# EAGLE design Beilage (EAGLE 9.6.2)
ABTEILUNG: Technische Informatik; BEARBEITER: Ihninger, Grundner; DATUM: 07/02/2022; DOKUMENTART: Schaltplan; GEZ: GruS; ID: 4AHEL; REV: 3; SCHALTPLAN: Sequencer; STATUS: Prototyp; VER: 2.0

## Sheet 1 of 5: Master Control
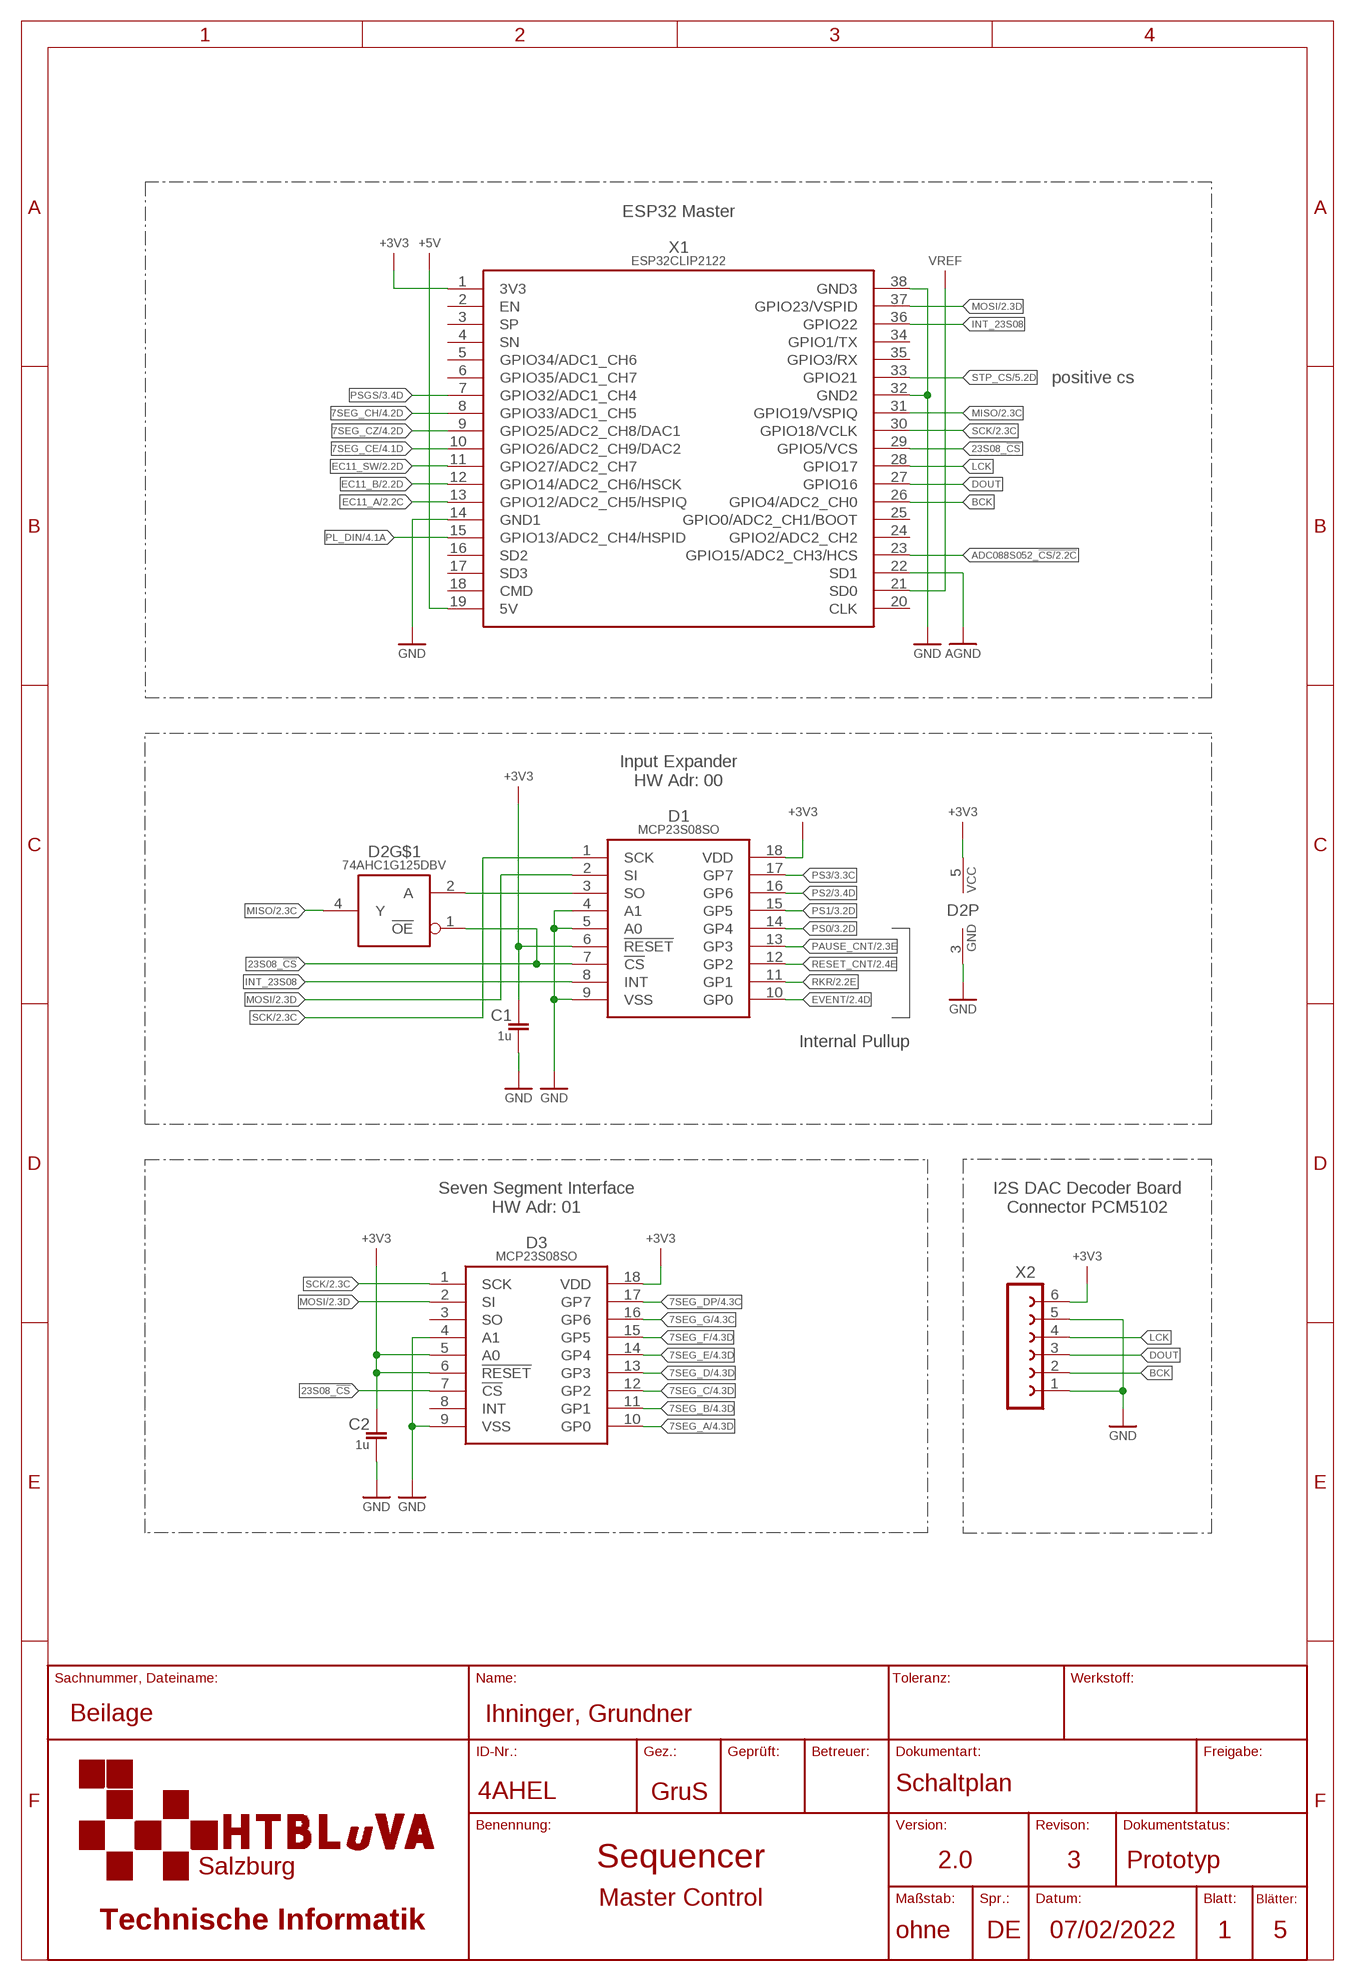
[diagram p0: schematic, sheet 1]

### Parts
C1  1u  C-EUC0805  [C0805]
C2  1u  C-EUC0805  [C0805]
D1  MCP23S08SO  [SO18W]
D2  74AHC1G125DBV  [SOT23-5]
D3  MCP23S08SO  [SO18W]
X1  ESP32CLIP2122  [ESP32-DEVKIT-C-CLIP]
X2  FE06-1  [FE06]

### Nets
7SEG_A: D3.10(GP0) ; also sheet 4
7SEG_B: D3.11(GP1) ; also sheet 4
7SEG_C: D3.12(GP2) ; also sheet 4
7SEG_CE: X1.10(GPIO26/ADC2_CH9/DAC2) ; also sheet 4
7SEG_CH: X1.8(GPIO33/ADC1_CH5) ; also sheet 4
7SEG_CZ: X1.9(GPIO25/ADC2_CH8/DAC1) ; also sheet 4
7SEG_D: D3.13(GP3) ; also sheet 4
7SEG_DP: D3.17(GP7) ; also sheet 4
7SEG_E: D3.14(GP4) ; also sheet 4
7SEG_F: D3.15(GP5) ; also sheet 4
7SEG_G: D3.16(GP6) ; also sheet 4
23S08_!CS: D1.7(!CS) D2.1(!OE) D3.7(!CS) X1.29(GPIO5/VCS)
+3V3: C1.1 C2.1 D1.6(!RESET) D1.18(VDD) D2.5(P:VCC) D3.5(A0) D3.6(!RESET) D3.18(VDD) X1.1(3V3) X2.6 ; also sheet 2,3,5
+5V: X1.19(5V) ; also sheet 2,4
ADC088S052_!CS: X1.23(GPIO15/ADC2_CH3/HCS) ; also sheet 2
AGND: X1.22(SD1) ; also sheet 2
BCK: X1.26(GPIO4/ADC2_CH0) X2.2
DOUT: X1.27(GPIO16) X2.3
EC11_A: X1.13(GPIO12/ADC2_CH5/HSPIQ) ; also sheet 2
EC11_B: X1.12(GPIO14/ADC2_CH6/HSCK) ; also sheet 2
EC11_SW: X1.11(GPIO27/ADC2_CH7) ; also sheet 2
EVENT: D1.10(GP0) ; also sheet 2
GND: C1.2 C2.2 D1.4(A1) D1.5(A0) D1.9(VSS) D2.3(P:GND) D3.4(A1) D3.9(VSS) X1.14(GND1) X1.32(GND2) X1.38(GND3) X2.1 X2.5 ; also sheet 2,3,4,5
INT_23S08: D1.8(INT) X1.36(GPIO22)
LCK: X1.28(GPIO17) X2.4
MISO: D2.4(Y) X1.31(GPIO19/VSPIQ) ; also sheet 2
MOSI: D1.2(SI) D3.2(SI) X1.37(GPIO23/VSPID) ; also sheet 2,5
N$62: D1.3(SO) D2.2(A)
PAUSE_CNT: D1.13(GP3) ; also sheet 2
PL_DIN: X1.15(GPIO13/ADC2_CH4/HSPID) ; also sheet 4
PS0: D1.14(GP4) ; also sheet 3
PS1: D1.15(GP5) ; also sheet 3
PS2: D1.16(GP6) ; also sheet 3
PS3: D1.17(GP7) ; also sheet 3
PSGS: X1.7(GPIO32/ADC1_CH4) ; also sheet 3
RESET_CNT: D1.12(GP2) ; also sheet 2
RKR: D1.11(GP1) ; also sheet 2
SCK: D1.1(SCK) D3.1(SCK) X1.30(GPIO18/VCLK) ; also sheet 2,5
STP_CS: X1.33(GPIO21) ; also sheet 5
VREF: X1.21(SD0) ; also sheet 2
Unconnected: D3.3(SO) D3.8(INT) X1.2(EN) X1.3(SP) X1.4(SN) X1.5(GPIO34/ADC1_CH6) X1.6(GPIO35/ADC1_CH7) X1.16(SD2) X1.17(SD3) X1.18(CMD) X1.20(CLK) X1.24(GPIO2/ADC2_CH2) X1.25(GPIO0/ADC2_CH1/BOOT) X1.34(GPIO1/TX) X1.35(GPIO3/RX)

### Notes on the sheet
- ESP32 Master
- positive cs
- Input Expander
  HW Adr: 00
- Internal Pullup
- Seven Segment Interface
  HW Adr: 01
- I2S DAC Decoder Board
  Connector PCM5102

## Sheet 2 of 5: User Inputs Potentiometers for Pitch Settings Switch Inputs EC-11
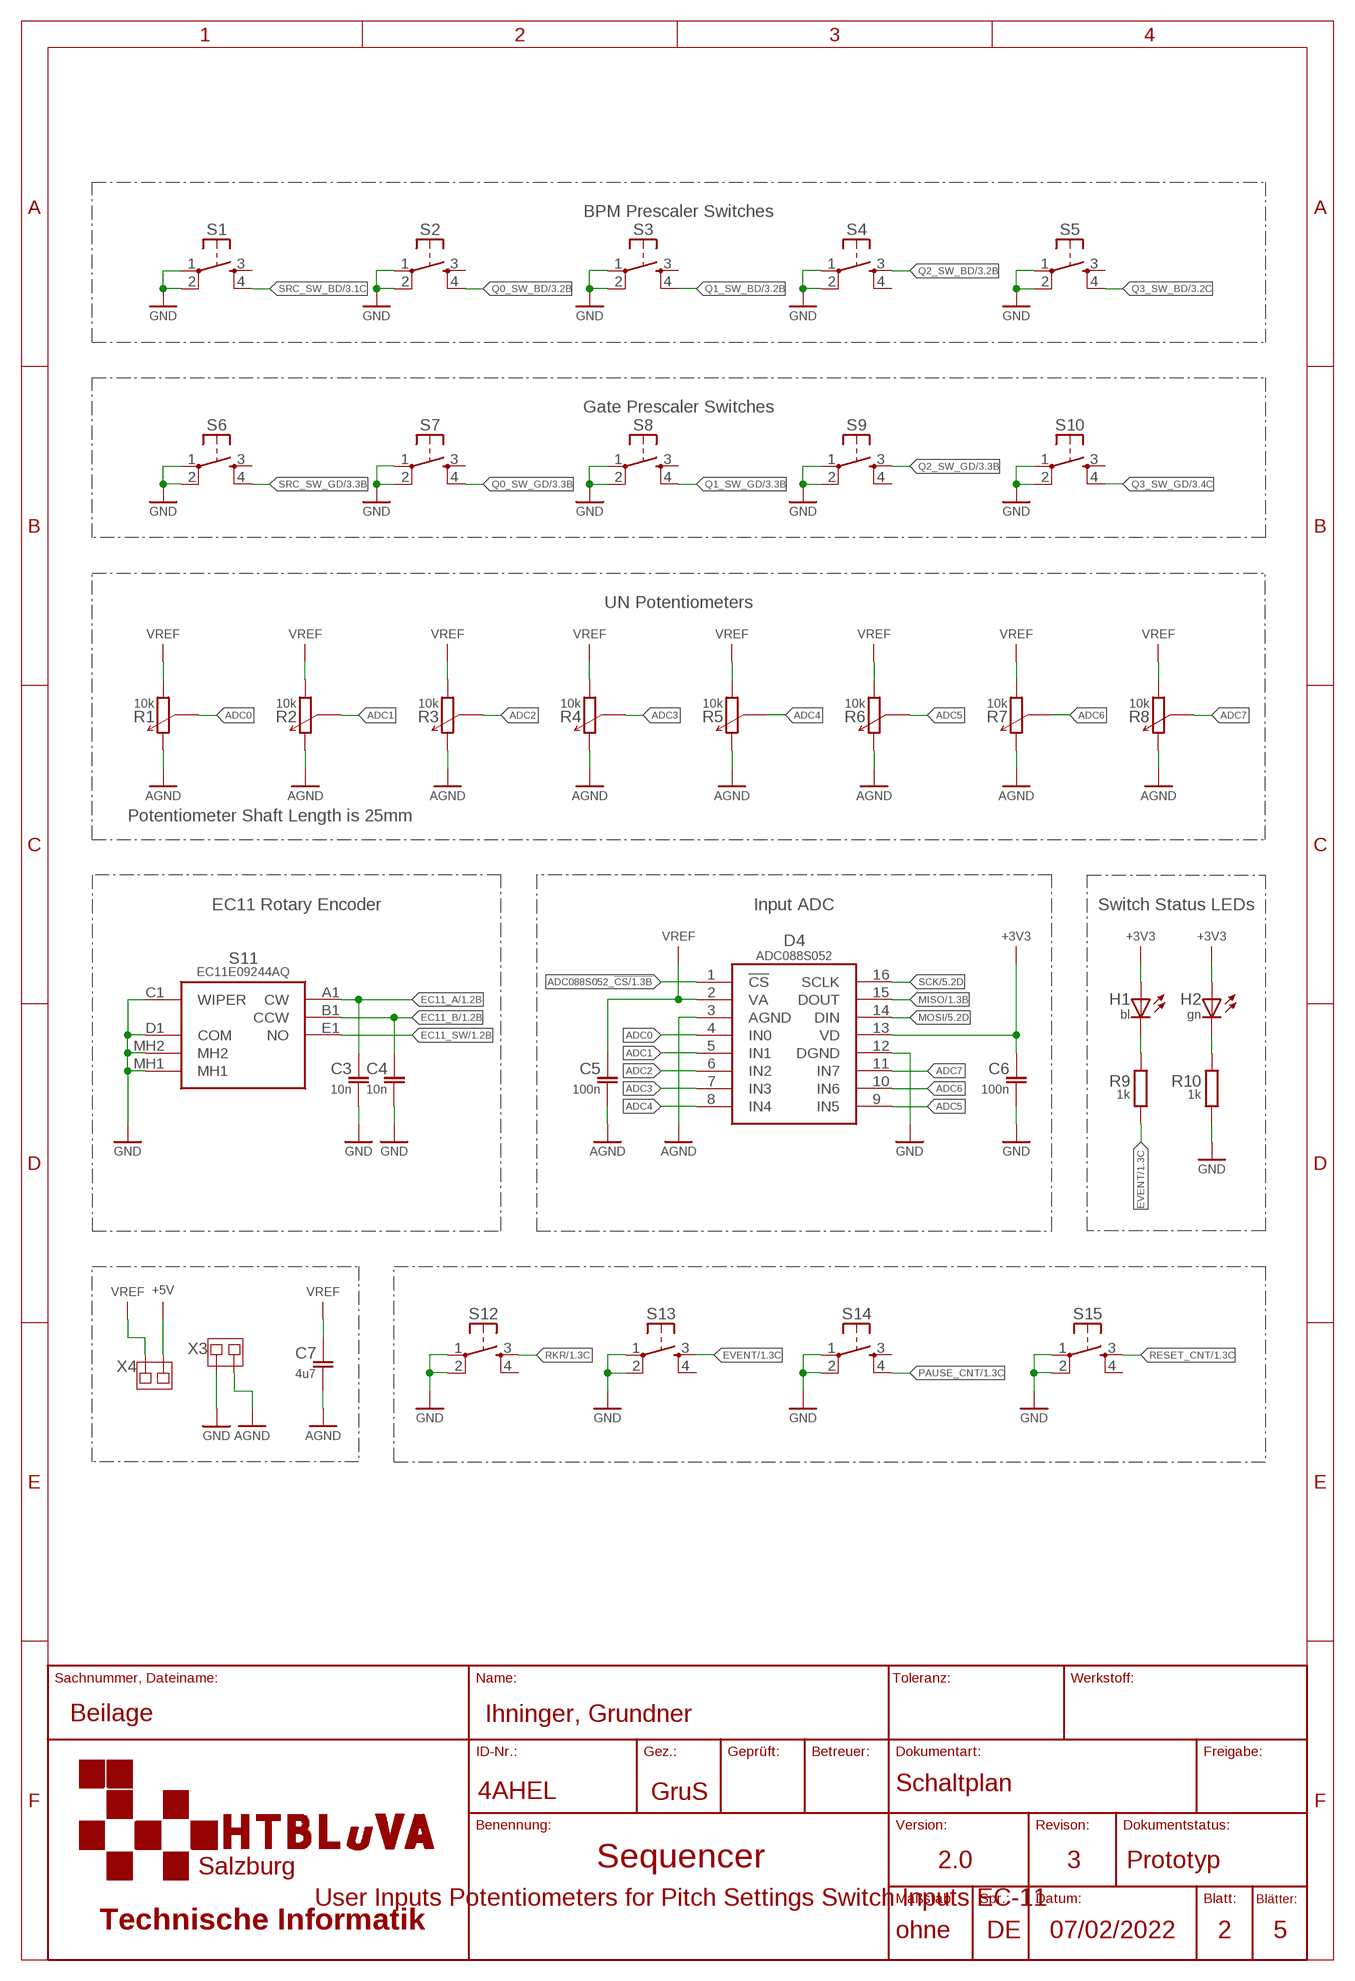
[diagram p1: schematic, sheet 2]

### Parts
C3  10n  C-EUC0805  [C0805]
C4  10n  C-EUC0805  [C0805]
C5  100n  C-EUC0805  [C0805]
C6  100n  C-EUC0805  [C0805]
C7  4u7  C-EUC0805  [C0805]
D4  ADC088S052  [TSSOP16]
H1  bl  LEDCHIPLED_1206  [CHIPLED_1206]
H2  gn  LEDCHIPLED_1206  [CHIPLED_1206]
R1  10k  P160LB  [P160LB]
R2  10k  P160LB  [P160LB]
R3  10k  P160LB  [P160LB]
R4  10k  P160LB  [P160LB]
R5  10k  P160LB  [P160LB]
R6  10k  P160LB  [P160LB]
R7  10k  P160LB  [P160LB]
R8  10k  P160LB  [P160LB]
R9  1k  R-EUSR0805  [R0805]
R10  1k  R-EUSR0805  [R0805]
S1  TASTE10XX  [B3F-10XX]
S2  TASTE10XX  [B3F-10XX]
S3  TASTE10XX  [B3F-10XX]
S4  TASTE10XX  [B3F-10XX]
S5  TASTE10XX  [B3F-10XX]
S6  TASTE10XX  [B3F-10XX]
S7  TASTE10XX  [B3F-10XX]
S8  TASTE10XX  [B3F-10XX]
S9  TASTE10XX  [B3F-10XX]
S10  TASTE10XX  [B3F-10XX]
S11  EC11E09244AQ  [EC11]
S12  TASTE10XX  [B3F-10XX]
S13  TASTE10XX  [B3F-10XX]
S14  TASTE10XX  [B3F-10XX]
S15  TASTE10XX  [B3F-10XX]
X3  JUMPSMD1FACH-1  [MYLIB_SJ]
X4  JUMPSMD1FACH-1  [MYLIB_SJ]

### Nets
+3V3: C6.1 D4.13(VD) H1.A H2.A ; also sheet 1,3,5
+5V: X4.1 ; also sheet 1,4
ADC0: D4.4(IN0) R1.2
ADC1: D4.5(IN1) R2.2
ADC2: D4.6(IN2) R3.2
ADC3: D4.7(IN3) R4.2
ADC4: D4.8(IN4) R5.2
ADC5: D4.9(IN5) R6.2
ADC6: D4.10(IN6) R7.2
ADC7: D4.11(IN7) R8.2
ADC088S052_!CS: D4.1(!CS) ; also sheet 1
AGND: C5.2 C7.2 D4.3(AGND) R1.3 R2.3 R3.3 R4.3 R5.3 R6.3 R7.3 R8.3 X3.2 ; also sheet 1
EC11_A: C3.1 S11.A1(CW) ; also sheet 1
EC11_B: C4.1 S11.B1(CCW) ; also sheet 1
EC11_SW: S11.E1(NO) ; also sheet 1
EVENT: R9.1 S13.3(S) ; also sheet 1
GND: C3.2 C4.2 C6.2 D4.12(DGND) R10.1 S1.1(P) S1.2(P1) S2.1(P) S2.2(P1) S3.1(P) S3.2(P1) S4.1(P) S4.2(P1) S5.1(P) S5.2(P1) S6.1(P) S6.2(P1) S7.1(P) S7.2(P1) S8.1(P) S8.2(P1) S9.1(P) S9.2(P1) S10.1(P) S10.2(P1) S11.C1(WIPER) S11.D1(COM) S11.MH1 S11.MH2 S12.1(P) S12.2(P1) S13.1(P) S13.2(P1) S14.1(P) S14.2(P1) S15.1(P) S15.2(P1) X3.1 ; also sheet 1,3,4,5
MISO: D4.15(DOUT) ; also sheet 1
MOSI: D4.14(DIN) ; also sheet 1,5
N$9: H2.C R10.2
N$58: H1.C R9.2
PAUSE_CNT: S14.4(S1) ; also sheet 1
Q0_SW_BD: S2.4(S1) ; also sheet 3
Q0_SW_GD: S7.4(S1) ; also sheet 3
Q1_SW_BD: S3.4(S1) ; also sheet 3
Q1_SW_GD: S8.4(S1) ; also sheet 3
Q2_SW_BD: S4.3(S) ; also sheet 3
Q2_SW_GD: S9.3(S) ; also sheet 3
Q3_SW_BD: S5.4(S1) ; also sheet 3
Q3_SW_GD: S10.4(S1) ; also sheet 3
RESET_CNT: S15.3(S) ; also sheet 1
RKR: S12.3(S) ; also sheet 1
SCK: D4.16(SCLK) ; also sheet 1,5
SRC_SW_BD: S1.4(S1) ; also sheet 3
SRC_SW_GD: S6.4(S1) ; also sheet 3
VREF: C5.1 C7.1 D4.2(VA) R1.1 R2.1 R3.1 R4.1 R5.1 R6.1 R7.1 R8.1 X4.2 ; also sheet 1
Unconnected: S1.3(S) S2.3(S) S3.3(S) S4.4(S1) S5.3(S) S6.3(S) S7.3(S) S8.3(S) S9.4(S1) S10.3(S) S12.4(S1) S13.4(S1) S14.3(S) S15.4(S1)

### Notes on the sheet
- BPM Prescaler Switches
- Gate Prescaler Switches
- UN Potentiometers
- Potentiometer Shaft Length is 25mm
- EC11 Rotary Encoder | Input ADC | Switch Status LEDs

## Sheet 3 of 5: Prescaler
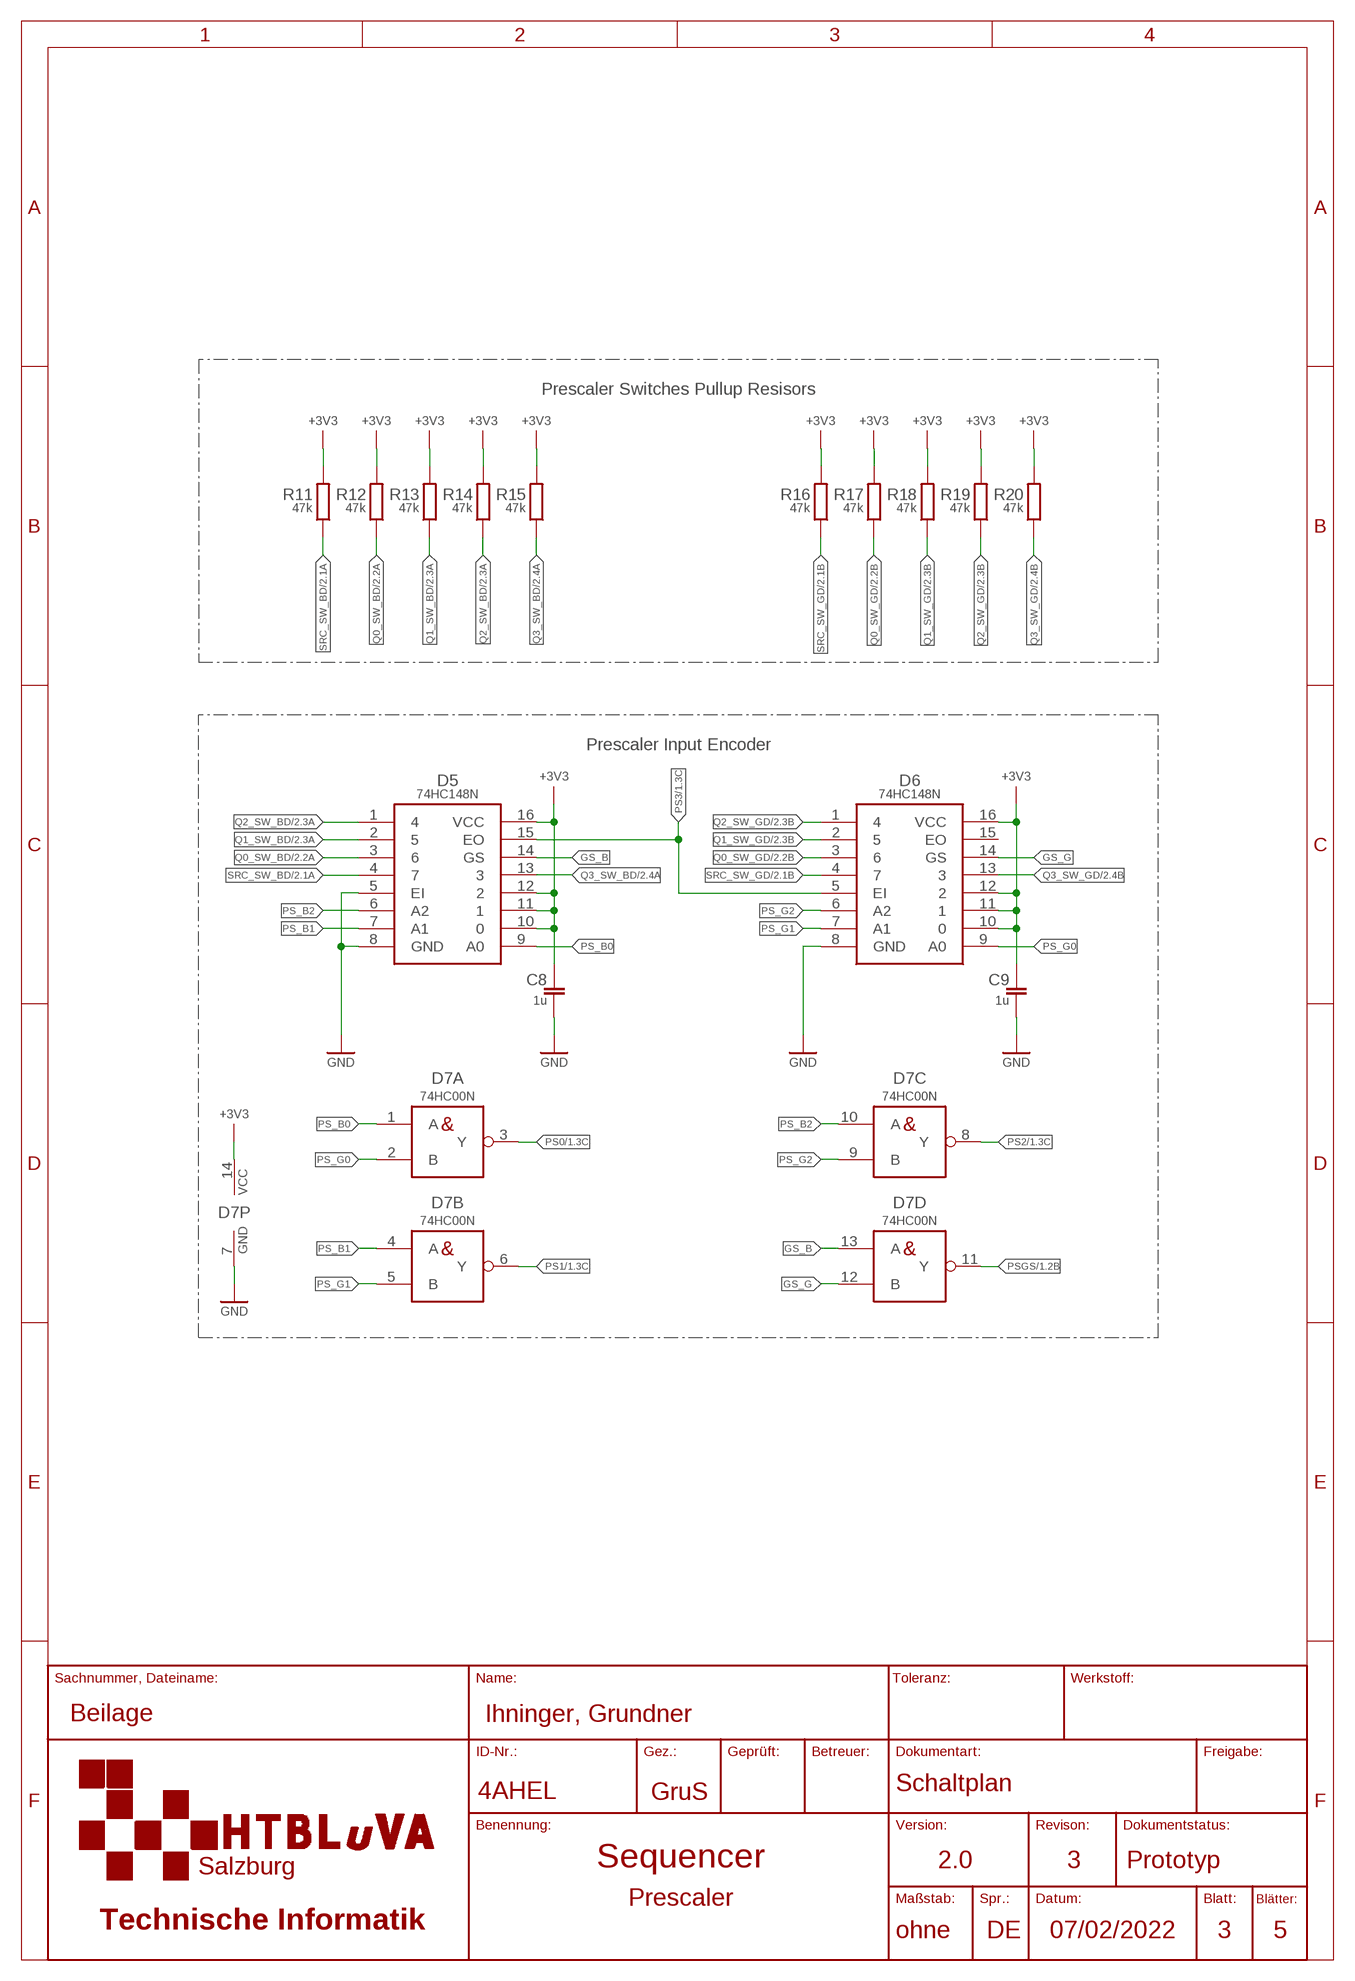
[diagram p2: schematic, sheet 3]

### Parts
C8  1u  C-EUC0805  [C0805]
C9  1u  C-EUC0805  [C0805]
D5  74HC148N  [DIP16]
D6  74HC148N  [DIP16]
D7  74HC00N  [DIP14]
R11  47k  R-EUSR0805  [R0805]
R12  47k  R-EUSR0805  [R0805]
R13  47k  R-EUSR0805  [R0805]
R14  47k  R-EUSR0805  [R0805]
R15  47k  R-EUSR0805  [R0805]
R16  47k  R-EUSR0805  [R0805]
R17  47k  R-EUSR0805  [R0805]
R18  47k  R-EUSR0805  [R0805]
R19  47k  R-EUSR0805  [R0805]
R20  47k  R-EUSR0805  [R0805]

### Nets
+3V3: C8.1 C9.1 D5.10 D5.11 D5.12 D5.16(VCC) D6.10 D6.11 D6.12 D6.16(VCC) D7.14(P:VCC) R11.2 R12.2 R13.2 R14.2 R15.2 R16.2 R17.2 R18.2 R19.2 R20.2 ; also sheet 1,2,5
GND: C8.2 C9.2 D5.5(EI) D5.8(GND) D6.8(GND) D7.7(P:GND) ; also sheet 1,2,4,5
GS_B: D5.14(GS) D7.13(D:A)
GS_G: D6.14(GS) D7.12(D:B)
PS0: D7.3(A:Y) ; also sheet 1
PS1: D7.6(B:Y) ; also sheet 1
PS2: D7.8(C:Y) ; also sheet 1
PS3: D5.15(EO) D6.5(EI) ; also sheet 1
PS_B0: D5.9(A0) D7.1(A:A)
PS_B1: D5.7(A1) D7.4(B:A)
PS_B2: D5.6(A2) D7.10(C:A)
PS_G0: D6.9(A0) D7.2(A:B)
PS_G1: D6.7(A1) D7.5(B:B)
PS_G2: D6.6(A2) D7.9(C:B)
PSGS: D7.11(D:Y) ; also sheet 1
Q0_SW_BD: D5.3 R12.1 ; also sheet 2
Q0_SW_GD: D6.3 R17.1 ; also sheet 2
Q1_SW_BD: D5.2 R13.1 ; also sheet 2
Q1_SW_GD: D6.2 R18.1 ; also sheet 2
Q2_SW_BD: D5.1 R14.1 ; also sheet 2
Q2_SW_GD: D6.1 R19.1 ; also sheet 2
Q3_SW_BD: D5.13 R15.1 ; also sheet 2
Q3_SW_GD: D6.13 R20.1 ; also sheet 2
SRC_SW_BD: D5.4 R11.1 ; also sheet 2
SRC_SW_GD: D6.4 R16.1 ; also sheet 2
Unconnected: D6.15(EO)

### Notes on the sheet
- Prescaler Switches Pullup Resisors
- Prescaler Input Encoder

## Sheet 4 of 5: Display & LEDs PL9823-F5 Rotating LEDs 7 Segment Display
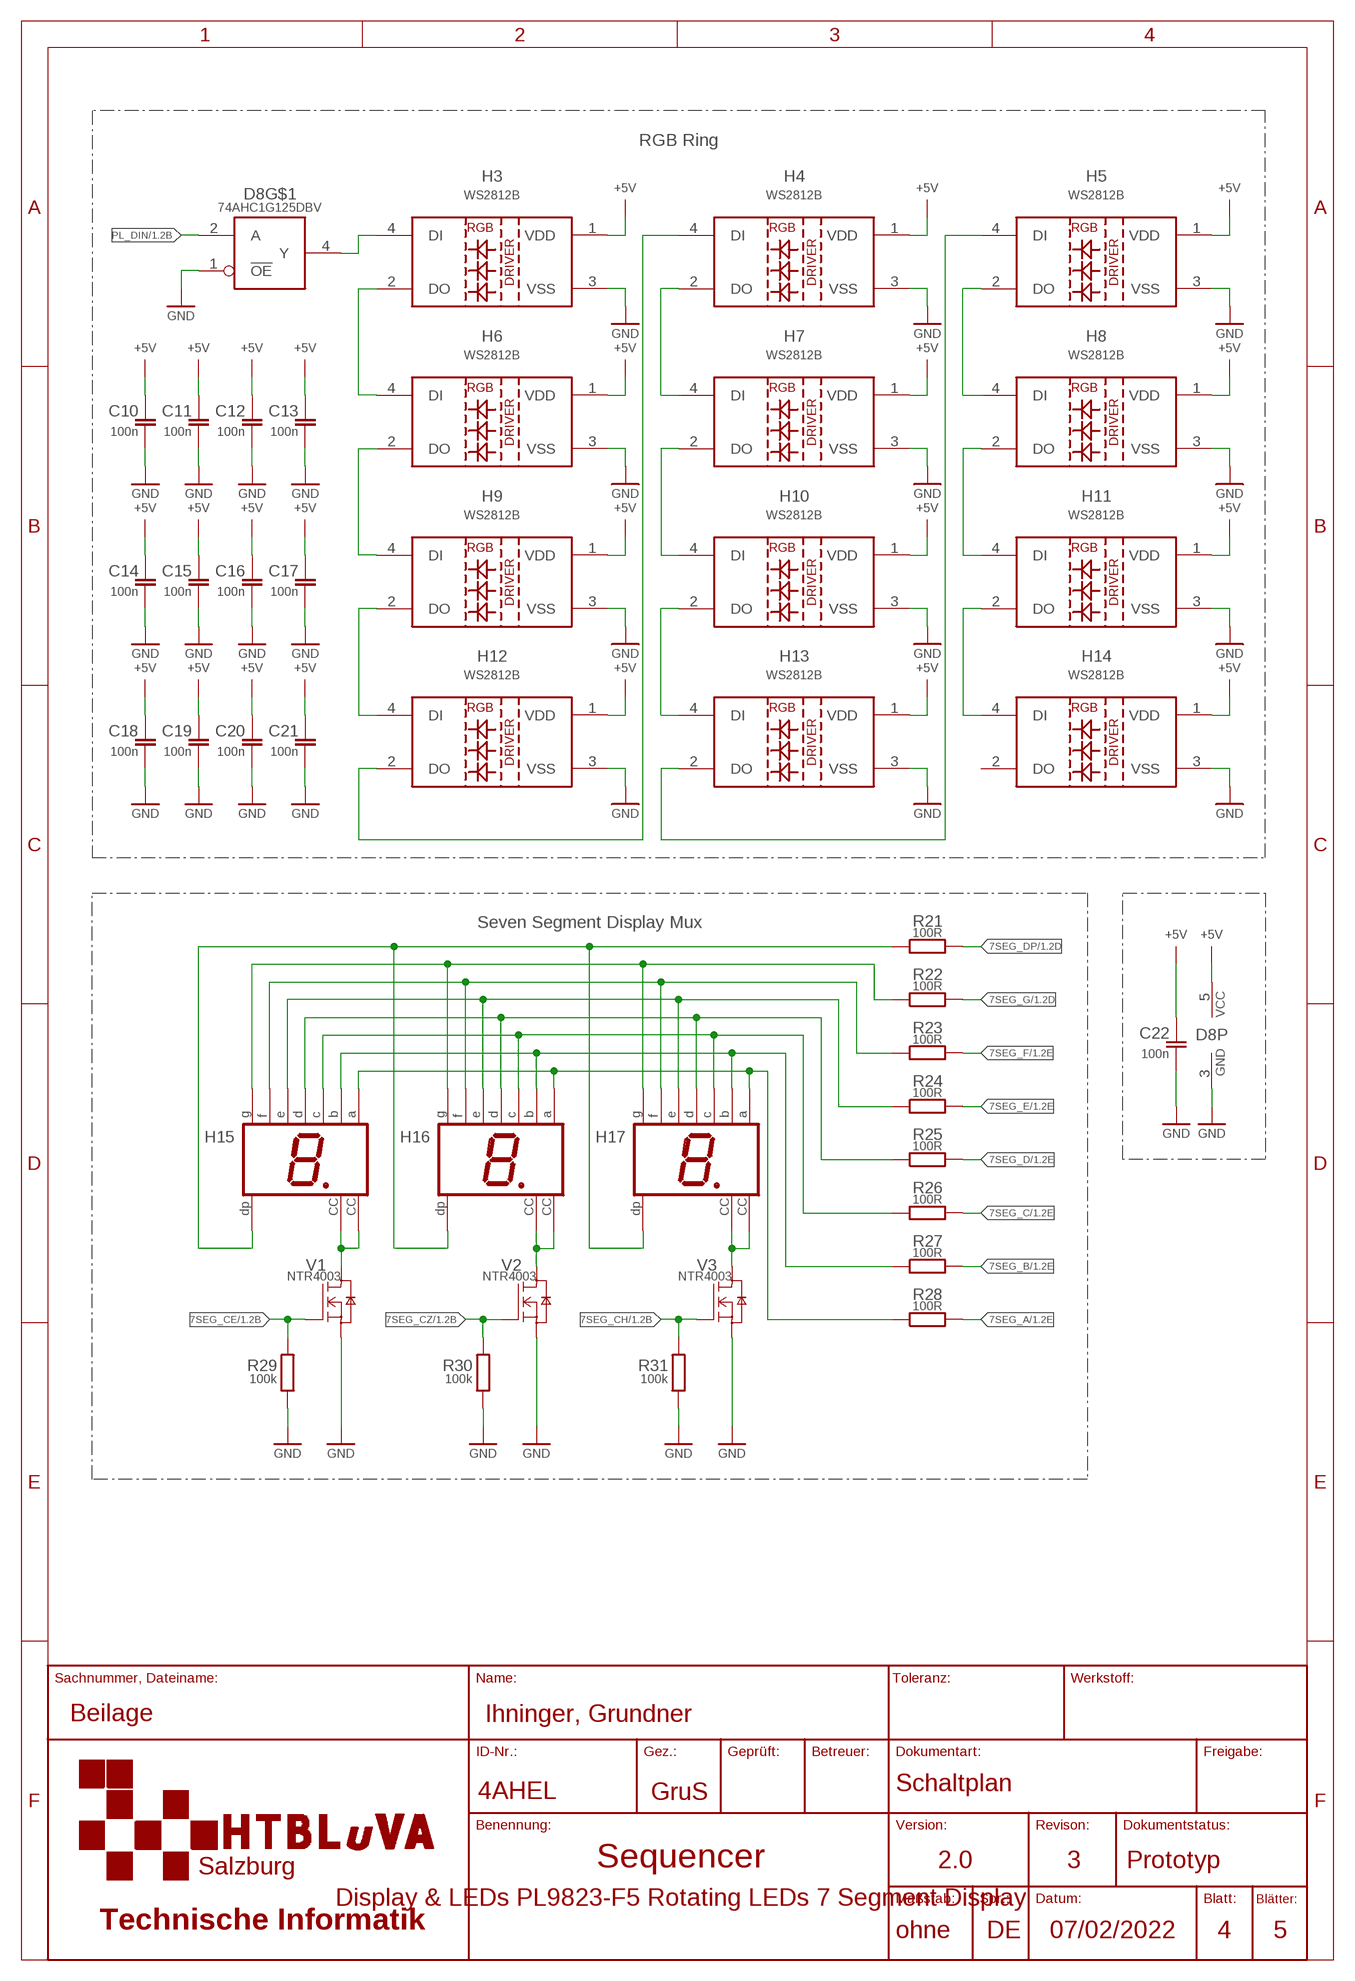
[diagram p3: schematic, sheet 4]

### Parts
C10  100n  C-EUC0805  [C0805]
C11  100n  C-EUC0805  [C0805]
C12  100n  C-EUC0805  [C0805]
C13  100n  C-EUC0805  [C0805]
C14  100n  C-EUC0805  [C0805]
C15  100n  C-EUC0805  [C0805]
C16  100n  C-EUC0805  [C0805]
C17  100n  C-EUC0805  [C0805]
C18  100n  C-EUC0805  [C0805]
C19  100n  C-EUC0805  [C0805]
C20  100n  C-EUC0805  [C0805]
C21  100n  C-EUC0805  [C0805]
C22  100n  C-EUC0805  [C0805]
D8  74AHC1G125DBV  [SOT23-5]
H3  WS2812B  [WS2812B]
H4  WS2812B  [WS2812B]
H5  WS2812B  [WS2812B]
H6  WS2812B  [WS2812B]
H7  WS2812B  [WS2812B]
H8  WS2812B  [WS2812B]
H9  WS2812B  [WS2812B]
H10  WS2812B  [WS2812B]
H11  WS2812B  [WS2812B]
H12  WS2812B  [WS2812B]
H13  WS2812B  [WS2812B]
H14  WS2812B  [WS2812B]
H15  HD-H103  [HDSP-E]
H16  HD-H103  [HDSP-E]
H17  HD-H103  [HDSP-E]
R21  100R  R-EU_R0805  [R0805]
R22  100R  R-EU_R0805  [R0805]
R23  100R  R-EU_R0805  [R0805]
R24  100R  R-EU_R0805  [R0805]
R25  100R  R-EU_R0805  [R0805]
R26  100R  R-EU_R0805  [R0805]
R27  100R  R-EU_R0805  [R0805]
R28  100R  R-EU_R0805  [R0805]
R29  100k  R-EUSR0805  [R0805]
R30  100k  R-EUSR0805  [R0805]
R31  100k  R-EUSR0805  [R0805]
V1  NTR4003  [SOT23]
V2  NTR4003  [SOT23]
V3  NTR4003  [SOT23]

### Nets
7SEG_A: R28.2 ; also sheet 1
7SEG_B: R27.2 ; also sheet 1
7SEG_C: R26.2 ; also sheet 1
7SEG_CE: R29.2 V1.1(G) ; also sheet 1
7SEG_CH: R31.2 V3.1(G) ; also sheet 1
7SEG_CZ: R30.2 V2.1(G) ; also sheet 1
7SEG_D: R25.2 ; also sheet 1
7SEG_DP: R21.2 ; also sheet 1
7SEG_E: R24.2 ; also sheet 1
7SEG_F: R23.2 ; also sheet 1
7SEG_G: R22.2 ; also sheet 1
+5V: C10.1 C11.1 C12.1 C13.1 C14.1 C15.1 C16.1 C17.1 C18.1 C19.1 C20.1 C21.1 C22.1 D8.5(P:VCC) H3.1(VDD) H4.1(VDD) H5.1(VDD) H6.1(VDD) H7.1(VDD) H8.1(VDD) H9.1(VDD) H10.1(VDD) H11.1(VDD) H12.1(VDD) H13.1(VDD) H14.1(VDD) ; also sheet 1,2
GND: C10.2 C11.2 C12.2 C13.2 C14.2 C15.2 C16.2 C17.2 C18.2 C19.2 C20.2 C21.2 C22.2 D8.1(!OE) D8.3(P:GND) H3.3(VSS) H4.3(VSS) H5.3(VSS) H6.3(VSS) H7.3(VSS) H8.3(VSS) H9.3(VSS) H10.3(VSS) H11.3(VSS) H12.3(VSS) H13.3(VSS) H14.3(VSS) R29.1 R30.1 R31.1 V1.2(S) V2.2(S) V3.2(S) ; also sheet 1,2,3,5
N$1: D8.4(Y) H3.4(DI)
N$2: H6.2(DO) H9.4(DI)
N$3: H3.2(DO) H6.4(DI)
N$4: H8.2(DO) H11.4(DI)
N$7: H15.DP H16.DP H17.DP R21.1
N$33: H15.G H16.G H17.G R22.1
N$35: H15.F H16.F H17.F R23.1
N$36: H15.A H16.A H17.A R28.1
N$37: H15.B H16.B H17.B R27.1
N$55: H15.CC1(CC) H15.CC2(CC) V1.3(D)
N$56: H15.D H16.D H17.D R25.1
N$57: H10.2(DO) H13.4(DI)
N$59: H5.4(DI) H13.2(DO)
N$63: H5.2(DO) H8.4(DI)
N$64: H16.CC1(CC) H16.CC2(CC) V2.3(D)
N$65: H17.CC1(CC) H17.CC2(CC) V3.3(D)
N$67: H7.2(DO) H10.4(DI)
N$68: H9.2(DO) H12.4(DI)
N$69: H11.2(DO) H14.4(DI)
N$70: H4.4(DI) H12.2(DO)
N$73: H4.2(DO) H7.4(DI)
N$78: H15.C H16.C H17.C R26.1
N$80: H15.E H16.E H17.E R24.1
PL_DIN: D8.2(A) ; also sheet 1
Unconnected: H14.2(DO)

### Notes on the sheet
- RGB Ring
- Seven Segment Display Mux

## Sheet 5 of 5: LED Driver LED Register PL-9823-F5 LEDs
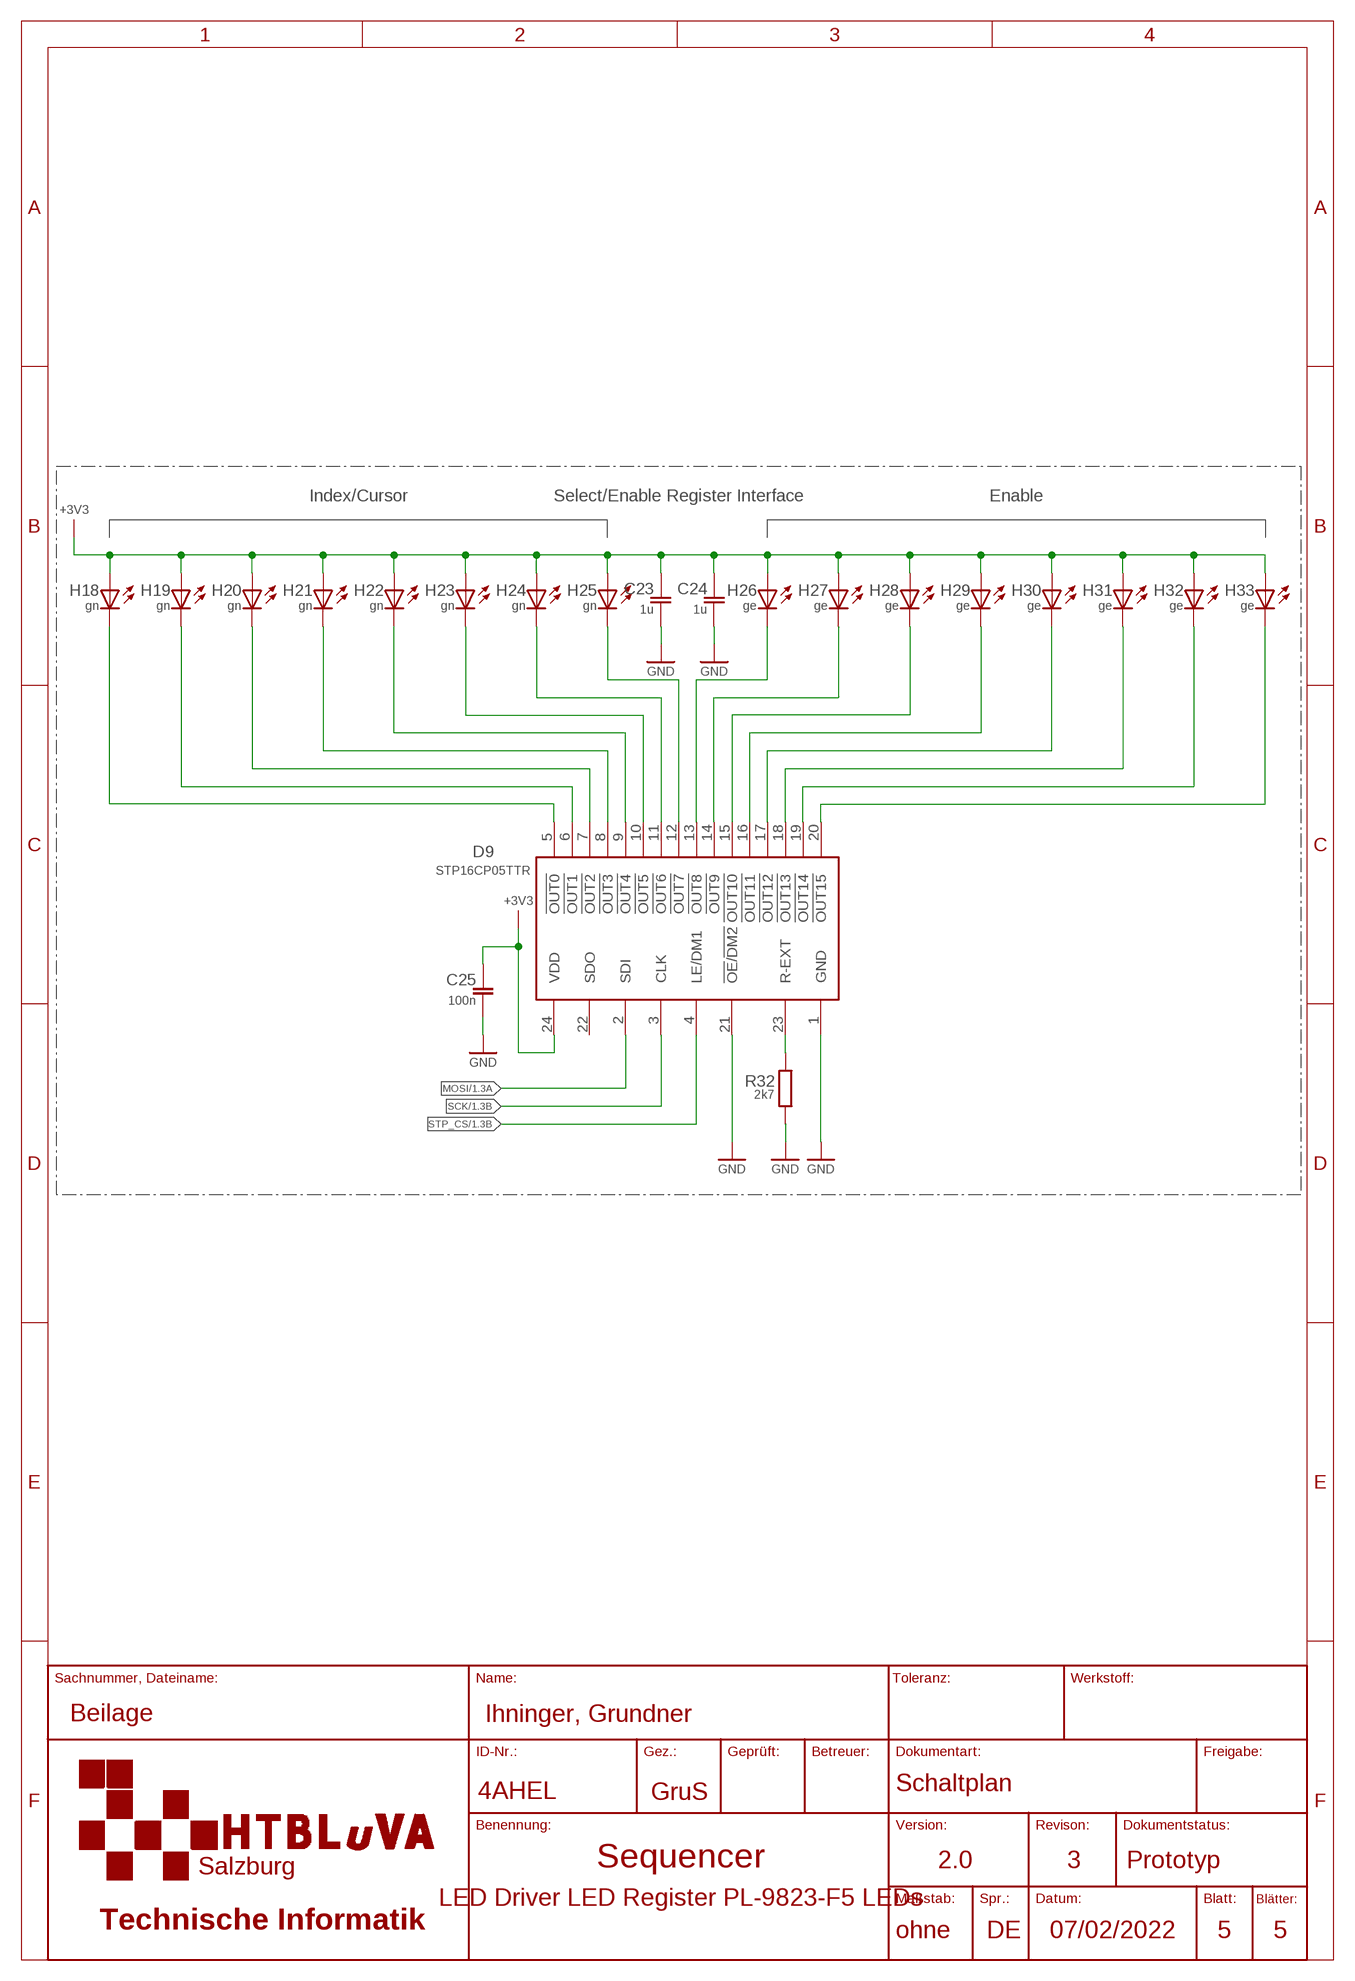
[diagram p4: schematic, sheet 5]

### Parts
C23  1u  C-EUC0805  [C0805]
C24  1u  C-EUC0805  [C0805]
C25  100n  C-EUC0805  [C0805]
D9  STP16CP05TTR  [TSSOP24]
H18  gn  LED5MM  [LED5MM]
H19  gn  LED5MM  [LED5MM]
H20  gn  LED5MM  [LED5MM]
H21  gn  LED5MM  [LED5MM]
H22  gn  LED5MM  [LED5MM]
H23  gn  LED5MM  [LED5MM]
H24  gn  LED5MM  [LED5MM]
H25  gn  LED5MM  [LED5MM]
H26  ge  LED5MM  [LED5MM]
H27  ge  LED5MM  [LED5MM]
H28  ge  LED5MM  [LED5MM]
H29  ge  LED5MM  [LED5MM]
H30  ge  LED5MM  [LED5MM]
H31  ge  LED5MM  [LED5MM]
H32  ge  LED5MM  [LED5MM]
H33  ge  LED5MM  [LED5MM]
R32  2k7  R-EUSR0805  [R0805]

### Nets
+3V3: C23.1 C24.1 C25.1 D9.24(VDD) H18.A H19.A H20.A H21.A H22.A H23.A H24.A H25.A H26.A H27.A H28.A H29.A H30.A H31.A H32.A H33.A ; also sheet 1,2,3
GND: C23.2 C24.2 C25.2 D9.1(GND) D9.21(!OE!/!DM2) R32.1 ; also sheet 1,2,3,4
MOSI: D9.2(SDI) ; also sheet 1,2
N$38: D9.5(!OUT0) H18.K(C)
N$39: D9.6(!OUT1) H19.K(C)
N$40: D9.7(!OUT2) H20.K(C)
N$41: D9.8(!OUT3) H21.K(C)
N$42: D9.9(!OUT4) H22.K(C)
N$43: D9.10(!OUT5) H23.K(C)
N$44: D9.11(!OUT6) H24.K(C)
N$45: D9.12(!OUT7) H25.K(C)
N$46: D9.13(!OUT8) H26.K(C)
N$47: D9.14(!OUT9) H27.K(C)
N$48: D9.15(!OUT10) H28.K(C)
N$49: D9.16(!OUT11) H29.K(C)
N$50: D9.17(!OUT12) H30.K(C)
N$51: D9.18(!OUT13) H31.K(C)
N$52: D9.19(!OUT14) H32.K(C)
N$53: D9.20(!OUT15) H33.K(C)
N$54: D9.23(R-EXT) R32.2
SCK: D9.3(CLK) ; also sheet 1,2
STP_CS: D9.4(LE/DM1) ; also sheet 1
Unconnected: D9.22(SDO)

### Notes on the sheet
- Index/Cursor | Select/Enable Register Interface | Enable

## Library data of the parts
C1-C25 = rcl_GruS:C-EU: CAPACITOR, European symbol; CATEGORY: 2
D1 D3 = ic_GruS:MCP23S08: 8-bit I/O Expander,SPI,MCP23S08-E/SO Source: Datasheet <https://datasheet.datasheetarchive.com/originals/distributors/SFDatasheet-4/sf-00090055.pdf>; ARROW_PART_NUMBER: MCP23S08-E/SO; ARROW_PRICE-STOCK: https://www.arrow.com/en/products/mcp23s08-eso/microchip-technology?region=nac; CATEGORY: 13; DESCRIPTION: 8-bit I/O Expander,SPI,MCP23S08-E/SO; HEIGHT: 2.65mm; MANUFACTURER_NAME: Microchip; MANUFACTURER_PART_NUMBER: MCP23S08-E/SO; MOUSER_PART_NUMBER: 579-MCP23S08-E/SO; MOUSER_PRICE-STOCK: https://www.mouser.co.uk/ProductDetail/Microchip-Technology/MCP23S08-E-SO?qs=Sez7gRs8XSXMFunLZ5Ve%2FA%3D%3D
D2 D8 = 74xx_GruS:74*1G125: Single Bus Buffer Gate with 3-State Output; CATEGORY: 13
D4 = adc-dac_GruS:ADC088S052: 8-Channel, 200 ksps to 500 ksps, 8-Bit A/D Converter Source: Datasheet <http://www.ti.com/lit/gpn/adc088s052>; ARROW_PART_NUMBER: ADC088S052CIMT/NOPB; ARROW_PRICE-STOCK: https://www.arrow.com/en/products/adc088s052cimtnopb/texas-instruments?region=nac; CATEGORY: 2; DESCRIPTION: 8-Channel, 200 ksps to 500 ksps, 8-Bit A/D Converter; HEIGHT: 1.2mm; MANUFACTURER_NAME: Texas Instruments; MANUFACTURER_PART_NUMBER: ADC088S052CIMT/NOPB; MOUSER_PART_NUMBER: 926-AD088S052CIMTNPB; MOUSER_PRICE-STOCK: https://www.mouser.co.uk/ProductDetail/Texas-Instruments/ADC088S052CIMT-NOPB?qs=7X5t%252BdzoRHDIs0QC27A8hw%3D%3D
D5 D6 = 74xx_GruS:74*148: Priority encoder,SN74HC148N DIL16 25pcs Source: Datasheet <http://www.ti.com/lit/gpn/sn74hc148>; CATEGORY: 13
D7 = 74xx_GruS:74*00: Quad 2-Input Logic NAND Datasheet Dist.: Art. Nr.:; CATEGORY: 13
D9 = ic_GruS:STP16CP05: STP16CP05 Source: Datasheet <http://www.st.com/st-web-ui/static/active/en/resource/technical/document/datasheet/CD00126634.pdf>; CATEGORY: 13
H1 H2 H18-H33 = led_GruS:LED: LED, EN-60617 OSRAM: - CHIPLED LG R971, LG N971, LY N971, LG Q971, LY Q971, LO R971, LY R971 LH N974, LH R974 LS Q976, LO Q976, LY Q976 LO Q996 - Hyper CHIPLED LW Q18S LB Q993, LB Q99A, LB R99A - SideLED LS A670, LO A670, LY A670, LG A670, LP A670 LB A673, LV A673, LT A673, LW A673 LH A674 LY A675 LS A676, LA A676, LO A676, LY A676, LW A676 LS A679, LY A679, LG A679 - Hyper Micro SIDELED® LS Y876, LA Y876, LO Y876, LY Y876 LT Y87S - SmartLED LW L88C, LW L88S LB L89C, LB L89S, LG L890 LS L89K, LO L89K, LY L89K LS L896, LA L896, LO L896, LY L896 - TOPLED LS T670, LO T670, LY T670, LG T670, LP T670 LSG T670, LSP T670, LSY T670, LOP T670, LYG T670 LG T671, LOG T671, LSG T671 LB T673, LV T673, LT T673, LW T673 LH T674 LS T676, LA T676, LO T676, LY T676, LB T676, LH T676, LSB T676, LW T676 LB T67C, LV T67C, LT T67C, LS T67K, LO T67K, LY T67K, LW E67C LS E67B, LA E67B, LO E67B, LY E67B, LB E67C, LV E67C, LT E67C LW T67C LS T679, LY T679, LG T679 LS T770, LO T770, LY T770, LG T770, LP T770 LB T773, LV T773, LT T773, LW T773 LH T774 LS E675, LA E675, LY E675, LS T675 LS T776, LA T776, LO T776, LY T776, LB T776 LHGB T686 LT T68C, LB T68C - Hyper Mini TOPLED® LB M676 - Mini TOPLED Santana® LG M470 LS M47K, LO M47K, LY M47K Source: http://www.osram.convergy.de LUXEON: - LUMILED® LXK2-PW12-R00, LXK2-PW12-S00, LXK2-PW14-U00, LXK2-PW14-V00 LXK2-PM12-R00, LXK2-PM12-S00, LXK2-PM14-U00 LXK2-PE12-Q00, LXK2-PE12-R00, LXK2-PE12-S00, LXK2-PE14-T00, LXK2-PE14-U00 LXK2-PB12-K00, LXK2-PB12-L00, LXK2-PB12-M00, LXK2-PB14-N00, LXK2-PB14-P00, LXK2-PB14-Q00 LXK2-PR12-L00, LXK2-PR12-M00, LXK2-PR14-Q00, LXK2-PR14-R00 LXK2-PD12-Q00, LXK2-PD12-R00, LXK2-PD12-S00 LXK2-PH12-R00, LXK2-PH12-S00 LXK2-PL12-P00, LXK2-PL12-Q00, LXK2-PL12-R00 Source: www.luxeon.com KINGBRIGHT: KA-3528ASYC Source: www.kingbright.com; CATEGORY: 7
H3-H14 = led_GruS:WS2812B; CATEGORY: 7
H15-H17 = display_GruS:HD-H103: LED DISPLAY 1-character 7 segment, decimal point right; CATEGORY: 15; OC_FARNELL: unknown; OC_NEWARK: unknown
R1-R8 = rcl_GruS:P160: Datasheet P160 <https://www.ttelectronics.com/TTElectronics/media/ProductFiles/Datasheets/P160.pdf> DigiKey Collection <https://www.digikey.com/en/products/filter/rotary-potentiometers-rheostats/84?s=N4IgjCBcoEwCxVAYygMwIYBsDOBTANCAPZQDaIcADDAGxgwgC6hADgC5QgDKbATgJYA7AOYgAvoRoBORCBSQMOAsTIgAzAA41NAKwNmIdpx4CR4wjB0bZ8xXkIlI5TXA1WmrDpG58hoiSA6agjQcmhY9ipO6gDslDQaEAZG3iZ%2B5oFwOjbhSg6q2jAxGpQehl4%2Bpv6EGlI0OQoRyo7OJcEIyRVpZgFglFoNds0FajCJ1p3Gvj2EfVIMobZN%2BdHaOmBgHZ5TVRlgGnAyi7mRLeBlKSAAkoJsuMK4vHtStYPLUeSlk6nT1SAwMH2bzyH3O3xAABEiABXABGmFwGQAtCFkCdhtFLBpLEwAkjssdGiCzmAYrjCEiIIShityC8yYwxEygA>
R9-R20 R29-R32 = rcl_GruS:R-EUS: RESISTOR, European symbol
R21-R28 = rcl_GruS:R-EU_: RESISTOR, European symbol
S1-S10 S12-S15 = switch_GruS:TASTE10XX: OMRON SWITCH; CATEGORY: 17
S11 = switch_GruS:EC11: Alps 9 Pulse Incremental Mechanical Rotary Encoder with a 6 mm Flat Shaft (Not Indexed), Through Hole// Source: Datasheet <https://componentsearchengine.com/Datasheets/2/EC11E09244BS.pdf>; CATEGORY: 17; DESCRIPTION: Alps 9 Pulse Incremental Mechanical Rotary Encoder with a 6 mm Flat Shaft (Not Indexed), Through Hole//; HEIGHT: 24.5mm; MANUFACTURER_NAME: ALPS; MANUFACTURER_PART_NUMBER: EC11E09244AQ; MOUSER_PART_NUMBER: 688-EC11E09244AQ; MOUSER_PRICE-STOCK: https://www.mouser.com/Search/Refine.aspx?Keyword=688-EC11E09244AQ
V1-V3 = mfet_GruS:NTR4003: Datasheet <https://www.mouser.de/datasheet/2/308/1/NTR4003N_D-2319203.pdf>; CATEGORY: 5
X1 = modul_GruS:ESP32; CATEGORY: 18
X2 = con-lsta:FE06-1: FEMALE HEADER; CATEGORY: 18
X3 X4 = con_GruS:JUMPSMD1FACH-1: SMD solder JUMPER; CATEGORY: 18

## Board
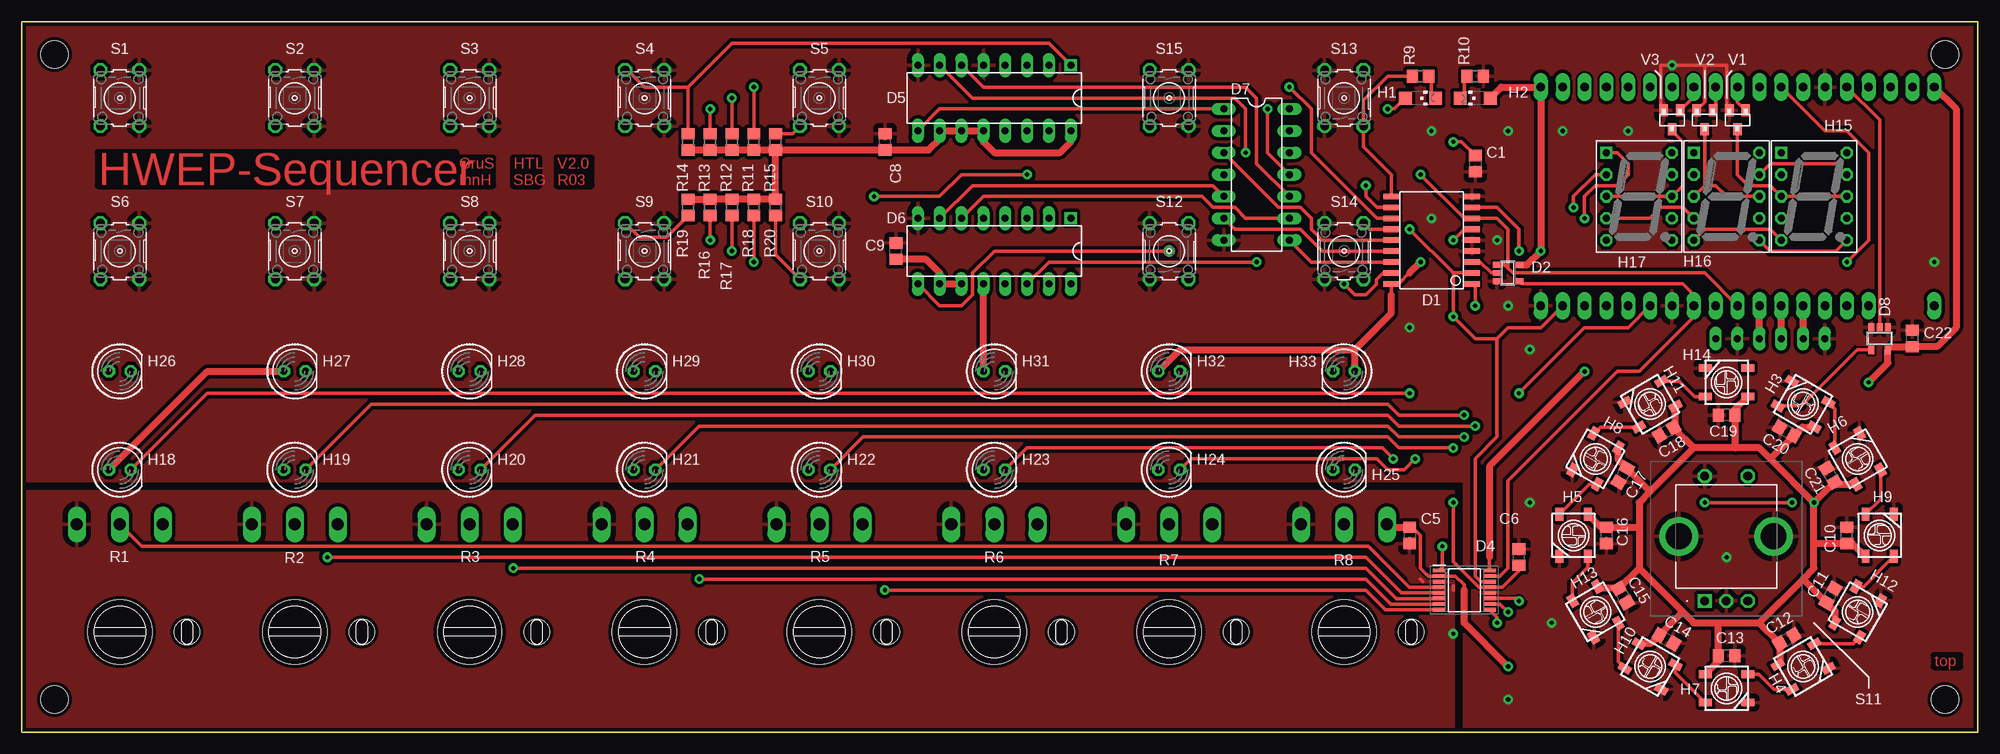
[diagram p5: board, top side]
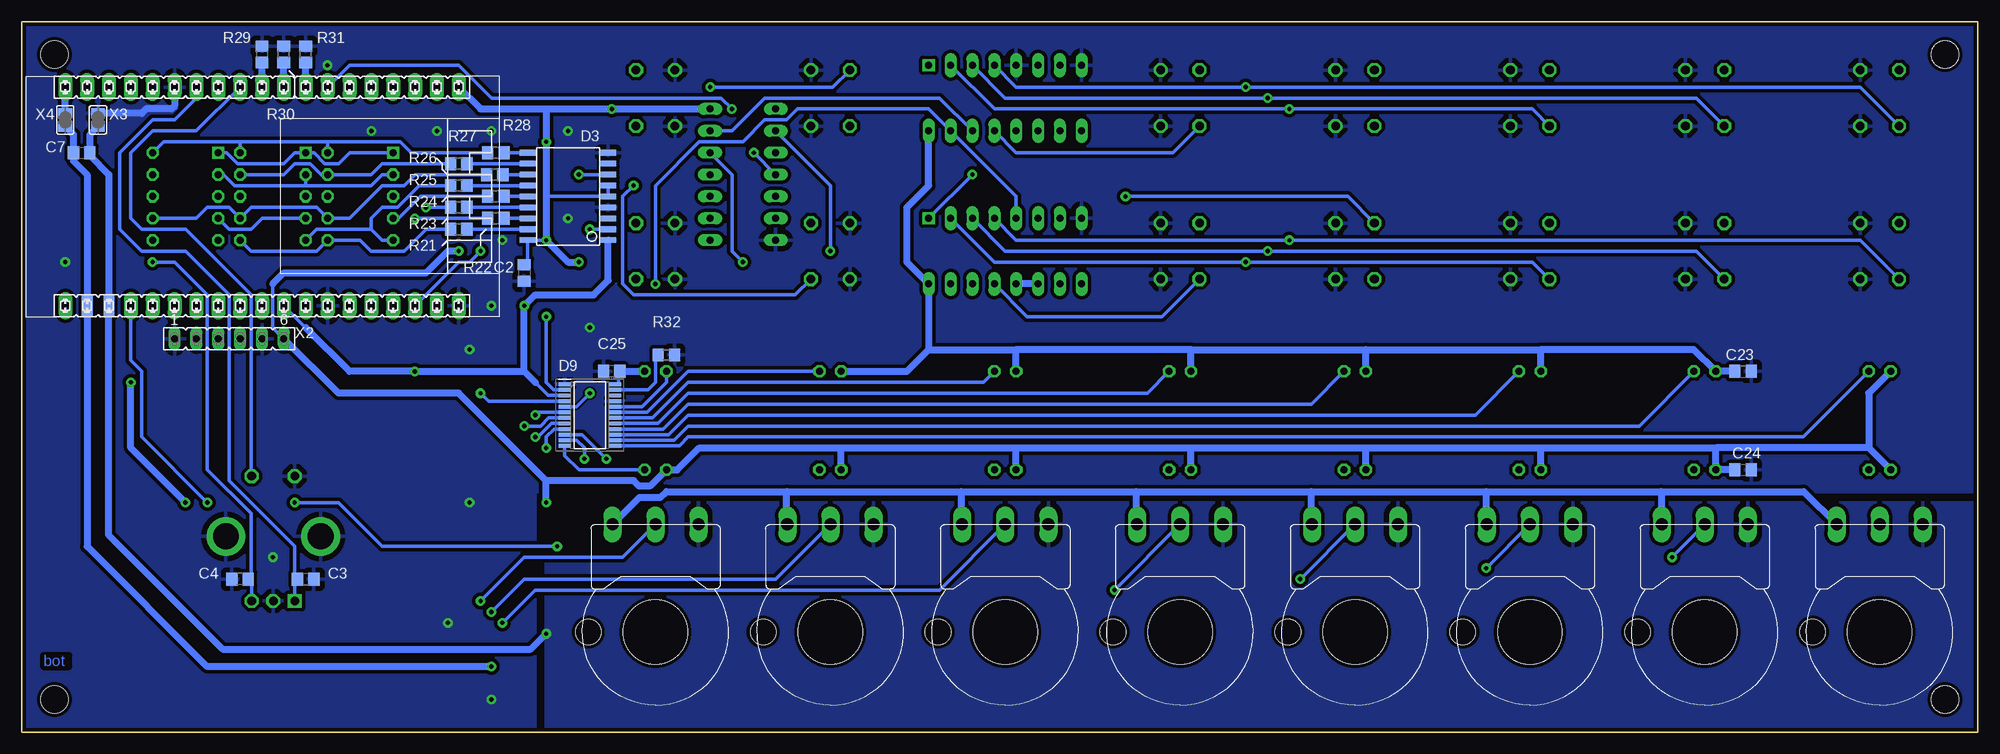
[diagram p6: board, bottom side, seen from below]

Size 227.33 x 82.55 mm. Coordinates in mm from the lower left corner, seen from the top.
Outline: 0,0 227.33,0 227.33,82.55 0,82.55 0,0
Copper layers (1+16): Top 0.035mm / dielectric 1.5mm / Bottom 0.035mm
Design rules "HTL_SMD_V1": minimum track width 10mil, minimum drill 0.5mm, track to track 8mil, track to pad 8mil, pad to pad 8mil, via to via 8mil, smd to smd 8mil, copper to edge 10mil, drill to drill 8mil, minimum pad ring 12mil, minimum via ring 12mil, stop-mask expansion 4mil, vias tented up to drill 20mil, thermal gap 24mil
Holes 3.2 mm at 3.81,3.81 3.81,78.74 223.52,78.74 223.52,3.81

### Footprints (pad centres in the part's own frame; a part is rotated, then mirrored left to right if it is on the bottom)
C0805 = smd 1.3 x 1.5: 1 -0.95,0; 2 0.95,0
SO18W = smd 1.85 x 0.65: 1 -4.675,5.08; 2 -4.675,3.81; 3 -4.675,2.54; 4 -4.675,1.27; 5 -4.675,0; 6 -4.675,-1.27; 7 -4.675,-2.54; 8 -4.675,-3.81; 9 -4.675,-5.08; 10 4.675,-5.08; 11 4.675,-3.81; 12 4.675,-2.54; 13 4.675,-1.27; 14 4.675,0; 15 4.675,1.27; 16 4.675,2.54; 17 4.675,3.81; 18 4.675,5.08
SOT23-5 = smd 0.69 x 0.99: 1 -0.95,-1.29; 2 0,-1.29; 3 0.95,-1.29; 4 0.95,1.3; 5 -0.95,1.3
TSSOP16 = smd 1.475 x 0.45: 1 -2.938,2.275; 2 -2.938,1.625; 3 -2.938,0.975; 4 -2.938,0.325; 5 -2.938,-0.325; 6 -2.938,-0.975; 7 -2.938,-1.625; 8 -2.938,-2.275; 9 2.938,-2.275; 10 2.938,-1.625; 11 2.938,-0.975; 12 2.938,-0.325; 13 2.938,0.325; 14 2.938,0.975; 15 2.938,1.625; 16 2.938,2.275
DIP16 = drill 0.813 square: 1 -8.89,-3.81 | drill 0.813 long: 2 -6.35,-3.81; 3 -3.81,-3.81; 4 -1.27,-3.81; 5 1.27,-3.81; 6 3.81,-3.81; 7 6.35,-3.81; 8 8.89,-3.81; 9 8.89,3.81; 10 6.35,3.81; 11 3.81,3.81; 12 1.27,3.81; 13 -1.27,3.81; 14 -3.81,3.81; 15 -6.35,3.81; 16 -8.89,3.81
DIP14 = drill 0.813 long: 1 -7.62,-3.81; 2 -5.08,-3.81; 3 -2.54,-3.81; 4 0,-3.81; 5 2.54,-3.81; 6 5.08,-3.81; 7 7.62,-3.81; 8 7.62,3.81; 9 5.08,3.81; 10 2.54,3.81; 11 0,3.81; 12 -2.54,3.81; 13 -5.08,3.81; 14 -7.62,3.81
TSSOP24 = smd 1.45 x 0.45: 1 -2.925,3.575; 2 -2.925,2.925; 3 -2.925,2.275; 4 -2.925,1.625; 5 -2.925,0.975; 6 -2.925,0.325; 7 -2.925,-0.325; 8 -2.925,-0.975; 9 -2.925,-1.625; 10 -2.925,-2.275; 11 -2.925,-2.925; 12 -2.925,-3.575; 13 2.925,-3.575; 14 2.925,-2.925; 15 2.925,-2.275; 16 2.925,-1.625; 17 2.925,-0.975; 18 2.925,-0.325; 19 2.925,0.325; 20 2.925,0.975; 21 2.925,1.625; 22 2.925,2.275; 23 2.925,2.925; 24 2.925,3.575
CHIPLED_1206 = smd 1.5 x 1.5: A 0,-1.75; C 0,1.75
WS2812B = smd 1.5 x 0.9: 1 -2.45,1.65; 2 -2.45,-1.65; 3 2.45,-1.65; 4 2.45,1.65
HDSP-E = drill 0.813 octagon: A 3.81,5.08; B 3.81,2.54; C 3.81,-2.54; CC1 3.81,0; CC2 -3.81,0; D -3.81,-5.08; DP 3.81,-5.08; E -3.81,-2.54; F -3.81,2.54 | drill 0.813 square: G -3.81,5.08
LED5MM = drill 0.813 octagon: A -1.27,0; K 1.27,0
P160LB = drill 1.4 long: 1 -5,0 | drill 1.4 pad 2.1 long: 2 0,0; 3 5,0 | hole 7.5: 0,12.5 | hole 3: -7.8,12.5
R0805 = smd 1.3 x 1.5: 1 -0.95,0; 2 0.95,0
B3F-10XX = drill 1 octagon: 1 -3.251,2.261; 2 3.251,2.261; 3 -3.251,-2.261; 4 3.251,-2.261
EC11 = drill 1 pad 1.5 square: A1 0,0 | drill 1 pad 1.5 octagon: B1 5,0; C1 2.5,0; D1 0,14.5; E1 5,14.5 | drill 3 pad 4.5: MH1 -3,7.5; MH2 8,7.5
SOT23 = smd 1 x 1.4: 1 -0.95,-1.1; 2 0.95,-1.1; 3 0,1.1
ESP32-DEVKIT-C-CLIP = drill 1 long: 1 0,0; 2 0,-2.54; 3 0,-5.08; 4 0,-7.62; 5 0,-10.16; 6 0,-12.7; 7 0,-15.24; 8 0,-17.78; 9 0,-20.32; 10 0,-22.86; 11 0,-25.4; 12 0,-27.94; 13 0,-30.48; 14 0,-33.02; 15 0,-35.56; 16 0,-38.1; 17 0,-40.64; 18 0,-43.18; 19 0,-45.72; 20 25.4,-45.72; 23 25.4,-38.1; 24 25.4,-35.56; 25 25.4,-33.02; 26 25.4,-30.48; 27 25.4,-27.94; 28 25.4,-25.4; 29 25.4,-22.86; 30 25.4,-20.32; 31 25.4,-17.78; 32 25.4,-15.24; 33 25.4,-12.7; 34 25.4,-10.16; 35 25.4,-7.62; 36 25.4,-5.08; 37 25.4,-2.54; 38 25.4,0 | smd 2.54 x 1.27: 21 25.4,-43.18; 22 25.4,-40.64
FE06 = drill 0.813 long: 1 -6.35,0; 2 -3.81,0; 3 -1.27,0; 4 1.27,0; 5 3.81,0; 6 6.35,0
MYLIB_SJ = smd 1.168 x 1.6: 1 -0.762,0; 2 0.762,0

### Placement (x,y rotation side)
C1  168.91,66.04 270 top
C2  168.91,53.34 270 bottom
C3  194.31,17.78 0 bottom
C4  201.93,17.78 180 bottom
C5  161.29,22.86 270 top
C6  173.99,20.32 90 top
C7  220.34,67.31 0 bottom
C8  100.33,68.58 90 top
C9  101.6,55.88 90 top
C10  212.09,22.86 90 top
C11  210.19,15.88 60 top
C12  205.1,10.79 30 top
C13  198.12,8.89 0 top
C14  191.13,10.79 330 top
C15  186.06,15.88 300 top
C16  184.15,22.86 270 top
C17  186.06,29.84 240 top
C18  191.13,34.92 210 top
C19  198.12,36.83 180 top
C20  205.1,34.92 150 top
C21  210.19,29.84 120 top
C22  219.71,45.72 90 top
C23  27.3,41.91 0 bottom
C24  27.3,30.48 0 bottom
C25  158.75,41.91 180 bottom
D1  163.83,57.15 180 top
D2  172.72,53.34 270 top
D3  163.83,62.23 180 bottom
D4  167.64,16.51 0 top
D5  113.03,73.66 180 top
D6  113.03,55.88 180 top
D7  143.51,64.77 270 top
D8  215.9,45.72 180 top
D9  161.29,36.83 0 bottom
FABRICATION  [FABRIACTION]  81.67,-10 0 top  (outside the outline)
H1  162.56,73.66 270 top
H2  168.91,73.66 90 top
H3  207.01,38.1 150 top
H4  207.01,7.62 30 top
H5  180.34,22.86 270 top
H6  213.36,31.75 120 top
H7  198.12,5.08 0 top
H8  182.88,31.75 240 top
H9  215.9,22.86 90 top
H10  189.23,7.62 330 top
H11  189.23,38.1 210 top
H12  213.36,13.97 60 top
H13  182.88,13.97 300 top
H14  198.12,40.64 180 top
H15  208.28,62.23 0 top
H16  198.12,62.23 0 top
H17  187.96,62.23 0 top
H18  11.43,30.48 0 top
H19  31.75,30.48 0 top
H20  52.07,30.48 0 top
H21  72.39,30.48 0 top
H22  92.71,30.48 0 top
H23  113.03,30.48 0 top
H24  133.35,30.48 0 top
H25  153.67,30.48 0 top
H26  11.43,41.91 0 top
H27  31.75,41.91 0 top
H28  52.07,41.91 0 top
H29  72.39,41.91 0 top
H30  92.71,41.91 0 top
H31  113.03,41.91 0 top
H32  133.35,41.91 0 top
H33  153.67,41.91 180 top
MEASURE  [MEASURE]  0,0 0 top
R1  11.43,24.13 180 top
R2  31.75,24.13 180 top
R3  52.07,24.13 180 top
R4  72.39,24.13 180 top
R5  92.71,24.13 180 top
R6  113.03,24.13 180 top
R7  133.35,24.13 180 top
R8  153.67,24.13 180 top
R9  162.56,76.2 0 top
R10  168.91,76.2 180 top
R11  85.09,68.58 270 top
R12  82.55,68.58 270 top
R13  80.01,68.58 270 top
R14  77.47,68.58 270 top
R15  87.63,68.58 270 top
R16  80.01,60.96 90 top
R17  82.55,60.96 90 top
R18  85.09,60.96 90 top
R19  77.47,60.96 90 top
R20  87.63,60.96 90 top
R21  176.53,58.42 0 bottom
R22  172.21,59.69 0 bottom
R23  176.53,60.96 0 bottom
R24  172.21,62.23 0 bottom
R25  176.53,63.5 0 bottom
R26  172.34,64.77 0 bottom
R27  176.53,66.04 0 bottom
R28  172.21,67.31 0 bottom
R29  199.39,78.74 270 bottom
R30  196.85,78.74 270 bottom
R31  194.31,78.74 270 bottom
R32  152.4,43.81 180 bottom
S1  11.43,73.66 270 top
S2  31.75,73.66 270 top
S3  52.07,73.66 270 top
S4  72.39,73.66 270 top
S5  92.71,73.66 270 top
S6  11.43,55.88 270 top
S7  31.75,55.88 270 top
S8  52.07,55.88 270 top
S9  72.39,55.88 270 top
S10  92.71,55.88 270 top
S11  195.58,15.24 0 top
S12  133.35,55.88 90 top
S13  153.67,73.66 90 top
S14  153.67,55.88 90 top
S15  133.35,73.66 270 top
V1  199.39,71.12 180 top
V2  195.58,71.12 180 top
V3  191.77,71.12 180 top
X1  176.53,74.93 270 bottom
X2  203.2,45.72 0 bottom
X3  218.44,71.12 270 bottom
X4  222.25,71.12 270 bottom

### Tracks (layer width: path | path; a pad name or v marks a point on that pad's centre or on a via)
7SEG_A
  Bottom 0.406: R28.2 D3.10
7SEG_B
  Bottom 0.406: D3.11 R27.2
7SEG_C
  Bottom 0.406: D3.12 R26.2
7SEG_CE
  Top 0.406: V1.1 199.39,73.17 X1.10
  Bottom 0.406: 199.39,77.47 R29.2
  Bottom 0.813: X1.10 199.39,77.47
7SEG_CH
  Top 0.406: X1.8 194.31,73.81 V3.1
  Bottom 0.813: X1.8 R31.2
7SEG_CZ
  Top 0.406: V2.1 196.85,72.54 X1.9
  Bottom 0.813: X1.9 R30.2
7SEG_D
  Bottom 0.406: D3.13 R25.2
7SEG_DP
  Bottom 0.406: R21.2 D3.17
7SEG_E
  Bottom 0.406: R24.2 D3.14
7SEG_F
  Bottom 0.406: R23.2 D3.15
7SEG_G
  Bottom 0.406: D3.16 R22.2
23S08_!CS  (via drill 0.5)
  Top 0.406: X1.29 195.58,53.34 173.27,53.34 172.72,53.89 | v162.56,64.77 167.64,59.69 D1.7 171.45,59.69 172.72,58.42 172.72,53.89 | D2.1 172.32,54.29 172.72,53.89
  Bottom 0.406: v162.56,64.77 D3.7
+3V3  (via drill 0.5)
  Top 0.406: C6.1 173.99,18.73 172.09,16.84 D4.13 169.35,16.84 166.37,19.81 v166.37,26.67 | v166.37,68.58 167.32,68.58 C1.1 | 159.16,50.8 D1.18 160.02,52.07 161.29,53.34 | v166.37,57.15 167.64,58.42 D1.6 | H1.A 159.54,72.39 v158.75,72.39
  Top 0.813: D5.16 121.92,68.58 120.65,67.31 113.03,67.31 111.76,68.58 D5.12 D5.11 D5.10 106.68,68.9 105.41,67.63 C8.1 R15.2 | 154.94,44.45 134.62,44.45 H32.A | H33.A 154.94,44.45 | 154.94,44.45 159.16,48.66 159.16,50.8 | H18.A 21.59,41.91 H27.A | R14.2 R13.2 R12.2 R11.2 R15.2 | R15.2 R20.2 R18.2 R17.2 R16.2 R19.2 | D6.11 D6.10 106.68,53.34 105.09,54.93 C9.1 | H31.A D6.12 | v162.56,54.61 161.29,53.34 | H2.A 171.93,74.93 X1.1 v176.53,55.88 174.94,54.29 D2.5
  Bottom 0.406: D3.6 D3.5 166.37,62.23 | X2.6 198.12,46.99 198.12,52.07 | C25.1 157.93,41.78 157.93,40.46 157.98,40.41 D9.24 | v166.37,57.15 D3.18 168.5,54.7 C2.1
  Bottom 0.813: D5.16 121.92,63.5 124.46,60.96 124.46,54.61 D6.16 121.92,44.45 | D6.11 D6.12 | 121.92,44.45 111.76,44.45 | 91.44,44.45 111.76,44.45 | 91.44,44.45 71.12,44.45 | 71.12,44.45 50.8,44.45 | H28.A 50.8,44.45 | H29.A 71.12,44.45 | H30.A 91.44,44.45 | H31.A 111.76,44.45 | H32.A 124.46,41.91 121.92,44.45 | 12.7,33.02 H18.A | 132.08,33.02 148.59,33.02 151.13,30.48 H25.A 154.31,28.57 155.57,28.57 156.21,29.21 166.37,29.21 | 132.08,33.02 111.76,33.02 | 111.76,33.02 91.44,33.02 | 91.44,33.02 71.12,33.02 | 71.12,33.02 50.8,33.02 | 50.8,33.02 30.48,33.02 | 30.48,33.02 H19.A C24.1 | H20.A 50.8,33.02 | H21.A 71.12,33.02 | H22.A 91.44,33.02 | H23.A 111.76,33.02 | H24.A 132.08,33.02 | C25.1 H33.A | X1.1 173.99,72.39 166.37,72.39 | 166.37,72.39 v158.75,72.39 D7.14 | X2.6 190.5,39.37 176.53,39.37 166.37,29.21 | v166.37,26.67 166.37,29.21 | 12.7,33.02 30.48,33.02 | 166.37,72.39 v166.37,68.58 166.37,62.23 v166.37,57.15 163.83,54.61 v162.56,54.61 | H26.A 12.7,39.37 12.7,33.02 | 50.8,44.45 33.02,44.45 H27.A C23.1 | v176.53,55.88 177.8,55.88 180.34,53.34 196.85,53.34 198.12,52.07
+5V  (via drill 0.5)
  Top 0.406: 201.93,12.7 201.93,12.67
  Top 0.813: H8.1 185.53,31.66 C17.1 189.23,27.97 189.23,27.94 | H11.1 192.18,35.62 C18.1 191.96,35.37 194.31,33.02 | H14.1 199.07,37.49 C19.1 199.07,33.09 199.14,33.02 | H3.1 206.92,35.45 C20.1 203.23,31.75 203.2,31.75 | H9.1 212.75,21.91 C10.1 208.35,21.91 208.28,21.84 | H4.1 204.28,8.04 C12.1 201.93,12.67 | H7.1 197.17,8.23 C13.1 197.17,12.64 197.23,12.7 | H10.1 189.32,10.27 C14.1 193.01,13.97 193.04,13.97 | H13.1 183.3,16.7 C15.1 185.61,16.7 187.96,19.05 | H5.1 183.49,23.81 C16.1 187.9,23.81 187.96,23.75 | 207.01,17.78 201.93,12.7 197.23,12.7 | 207.01,17.78 208.28,19.05 208.28,21.84 | 208.28,21.84 v208.28,26.67 | v208.28,26.67 203.2,31.75 | 203.2,31.75 201.93,33.02 199.14,33.02 | 199.14,33.02 194.31,33.02 | 194.31,33.02 189.23,27.94 | 189.23,27.94 187.96,26.67 187.96,23.75 | 187.96,23.75 187.96,19.05 | 187.96,19.05 193.04,13.97 | 193.04,13.97 194.31,12.7 197.23,12.7 | 207.01,17.78 209.71,15.08 C11.1 210.71,14.06 H12.1 | X1.19 224.79,72.39 224.79,46.99 222.57,44.77 C22.1 217.2,44.77 D8.5 216.85,42.86 v214.63,40.64 | v208.28,26.67 210.63,29.02 C21.1 210.88,28.8 H6.1
  Bottom 0.813: X4.1 X1.19 | v208.28,26.67 214.63,33.02 v214.63,40.64
ADC0
  Top 0.406: D4.4 164.68,16.85 161.26,16.85 156.52,21.59 13.97,21.59 R1.2
ADC1  (via drill 0.5)
  Top 0.406: D4.5 160.34,16.18 156.21,20.32 v35.56,20.32
  Bottom 0.406: v35.56,20.32 R2.2
ADC2  (via drill 0.5)
  Top 0.406: D4.6 164.68,15.52 163.8,15.52 163.77,15.49 159.76,15.49 156.21,19.05 v57.15,19.05
  Bottom 0.406: v57.15,19.05 R3.2
ADC3  (via drill 0.5)
  Top 0.406: D4.7 159.1,14.88 156.21,17.78 v78.74,17.78
  Bottom 0.406: v78.74,17.78 R4.2
ADC4  (via drill 0.5)
  Top 0.406: v100.33,16.51 156.21,16.51 158.49,14.23 D4.8
  Bottom 0.406: v100.33,16.51 R5.2
ADC5  (via drill 0.5)
  Top 0.406: D4.9 171.45,13.36 v171.45,12.7
  Bottom 0.406: v171.45,12.7 167.64,16.51 120.65,16.51 R6.2
ADC6  (via drill 0.5)
  Top 0.406: v172.72,13.97 171.81,14.88 D4.10
  Bottom 0.406: R7.2 139.7,17.78 168.91,17.78 v172.72,13.97
ADC7  (via drill 0.5)
  Top 0.406: D4.11 173.69,15.54 v173.99,15.24
  Bottom 0.406: v173.99,15.24 168.91,20.32 157.48,20.32 R8.2
ADC088S052_!CS  (via drill 0.5)
  Top 0.406: v165.1,21.59 165.1,19.18 D4.1 | v195.58,26.67 v205.74,26.67
  Bottom 0.406: X1.23 214.63,43.18 213.36,41.91 213.36,34.29 v205.74,26.67 | v165.1,21.59 185.42,21.59 190.5,26.67 v195.58,26.67
AGND  (via drill 0.5)
  Top 0.406: 166.37,17.02 166.37,16.51 | 162.56,17.78 162.85,17.48
  Bottom 0.813: X3.2 219.4,69.4 C7.2 219.4,67 217.17,64.77 X1.22 217.17,22.86 203.96,9.65 168.15,9.65 v166.37,11.43
  pour Top (isolate 0.406): 166.37,0 166.37,27.94 0,27.94 0,0
  pour Top (isolate 0.127): 161.29,19.05 161.29,16.51 166.37,16.51 166.37,19.05
  pour Bottom (isolate 0.406): 166.37,0 166.37,26.67 0,26.67 0,0
BCK
  Top 0.813: X2.2 X1.26
DOUT
  Top 0.813: X2.3 X1.27
EC11_A
  Bottom 0.406: X1.13 207.01,73.66 209.55,71.12 212.09,71.12 215.9,67.31 215.9,58.42 213.36,55.88 208.28,55.88 203.2,50.8 203.2,29.21 195.58,21.59 195.58,18.1 C3.1 195.58,17.46 S11.A1
EC11_B  (via drill 0.5)
  Top 0.406: v212.09,54.61 214.63,57.15 214.63,67.31 212.09,69.85 209.55,69.85 X1.12
  Bottom 0.406: S11.B1 200.58,17.38 C4.1 200.66,18.1 200.66,25.4 205.74,30.48 205.74,50.8 209.55,54.61 v212.09,54.61
EC11_SW
  Bottom 0.406: S11.E1 200.66,29.82 200.66,50.8 208.28,58.42 213.36,58.42 214.63,59.69 214.63,67.31 212.09,69.85 207.01,69.85 X1.11
EVENT
  Top 0.406: D1.10 159.16,64.77 155.93,67.99 S13.3 155.93,73.38 158.75,76.2 R9.1
GND  (via drill 0.5)
  Top 0.406: V3.2 190.5,72.54 190.5,77.47 v191.77,77.47 195.58,77.47 | 195.58,77.47 198.12,77.47 198.12,72.54 V1.2 | V2.2 195.58,73.17 195.58,77.47
  Bottom 0.813: X1.14 209.55,72.77 209.93,72.39 212.85,72.39 213.36,71.88 X3.1
  other vias: 175.26,44.45 161.29,46.99 186.69,69.85 172.72,49.53 163.83,59.69 163.83,69.85 175.26,26.67 177.8,12.7 198.12,20.32 222.25,54.61 179.07,69.85 172.72,69.85 171.45,57.15 172.72,3.81
  pour Top (isolate 0.254): 213.36,48.26 213.36,43.18 222.25,43.18 222.25,48.26
  pour Top (isolate 0.254): 168.91,58.42 168.91,50.8 175.26,50.8 175.26,58.42
  pour Top (isolate 0.127): 168.91,16.89 168.91,15.49 175.39,15.49 175.39,16.89
  pour Bottom (isolate 0.152): 157.48,41.91 157.48,36.83 165.1,36.83 165.1,41.91
  pour Top (isolate 0.254): 180.34,78.74 180.34,73.66 199.39,73.66 199.39,78.74
  pour Top (isolate 0.406): 0,82.55 227.33,82.55 227.33,0 167.64,0 167.64,29.21 0,29.21
  pour Bottom (isolate 0.406): 0,82.55 0,27.94 167.64,27.94 167.64,0 227.33,0 227.33,82.55
GS_B
  Bottom 0.406: D7.13 144.78,69.85 140.97,73.66 120.65,73.66 D5.14
GS_G  (via drill 0.5)
  Top 0.406: D6.14 119.38,54.61 v143.51,54.61
  Bottom 0.406: v143.51,54.61 144.78,55.88 144.78,64.77 D7.12
INT_23S08  (via drill 0.5)
  Top 0.406: D1.8 171.45,60.96 173.99,58.42 v173.99,55.88
  Bottom 0.406: X1.36 176.53,54.61 175.26,54.61 v173.99,55.88
LCK
  Top 0.813: X2.4 X1.28
MISO
  Top 0.406: D4.15 171.81,18.14 172.72,19.05 172.72,29.21 185.42,41.91 187.96,41.91 194.31,48.26 X1.31 194.31,50.8 193.04,52.07 174.34,52.07 D2.4
MOSI  (via drill 0.5)
  Top 0.406: D4.14 169.56,17.48 168.91,18.13 168.91,31.75 171.45,34.29 171.45,45.72 | X1.37 176.53,46.99 172.72,46.99 171.45,45.72 | D1.2 166.37,53.34 | 166.37,53.34 v161.29,58.42 | 166.37,53.34 v166.37,48.26 168.91,45.72 171.45,45.72
  Bottom 0.406: D9.2 165.49,39.76 166.37,40.64 v166.37,48.26 | D3.2 v161.29,58.42
N$1
  Top 0.406: H3.4 206.81,37.9 213.33,44.42 D8.4
N$2
  Top 0.406: H9.4 216.01,27.07 H6.2
N$3
  Top 0.406: H6.4 210.71,37.55 H3.2
N$4
  Top 0.406: H8.2 183.43,35.45 H11.4
N$7
  Top 0.406: H16.DP 203.2,55.88 210.82,55.88 H15.DP
  Bottom 0.406: R21.1 180.34,58.42 182.88,55.88 186.69,55.88 187.96,57.15 H17.DP 193.04,55.88 200.66,55.88 H16.DP
N$9
  Top 0.406: R10.2 167.64,75.88 167.64,74.14 H2.C
N$33  (via drill 0.5)
  Top 0.406: v181.61,59.69 181.61,62.23 182.88,63.5 185.42,63.5 186.69,64.77 186.69,66.04 185.42,67.31 H17.G
  Bottom 0.406: R22.1 v181.61,59.69 | H17.G 189.23,67.31 190.5,66.04 192.08,66.04 193.35,67.31 H16.G 195.58,67.31 196.85,66.04 202.24,66.04 203.51,67.31 H15.G
N$35  (via drill 0.5)
  Top 0.406: H17.F 182.88,64.77 180.34,62.23 v180.34,60.96
  Bottom 0.406: H17.F 185.42,64.77 186.69,63.5 194.31,63.5 | H15.F 203.84,64.77 202.56,63.5 194.31,63.5 | R23.1 v180.34,60.96 | H16.F 194.31,63.5
N$36
  Bottom 0.406: 191.77,68.58 183.32,68.58 182.05,67.31 R28.1 | 191.77,68.58 201.93,68.58 | 201.93,68.58 210.82,68.58 H15.A | H16.A 201.93,68.58 | H17.A 191.77,68.58
N$37
  Top 0.406: H16.B 203.2,66.04 210.82,66.04 H15.B
  Bottom 0.406: R27.1 185.42,66.04 186.69,64.77 H17.B 192.53,64.77 193.8,66.04 195.58,66.04 196.85,64.77 H16.B
N$38  (via drill 0.5)
  Top 0.406: H18.K 21.59,39.37 v161.29,39.37
  Bottom 0.406: D9.5 162.85,37.8 v161.29,39.37
N$39  (via drill 0.5)
  Top 0.406: H19.K 40.64,38.1 158.75,38.1 160.02,36.83 v167.64,36.83
  Bottom 0.406: D9.6 164.23,37.14 167.33,37.14 v167.64,36.83
N$40  (via drill 0.5)
  Top 0.406: H20.K 59.69,36.83 158.75,36.83 160.02,35.56 v168.91,35.56
  Bottom 0.406: D9.7 166.06,36.51 167,35.56 v168.91,35.56
N$41  (via drill 0.5)
  Top 0.406: H21.K 78.74,35.56 158.75,35.56 160.02,34.29 v167.64,34.29
  Bottom 0.406: D9.8 165.74,35.85 167.3,34.29 v167.64,34.29
N$42  (via drill 0.5)
  Top 0.406: H22.K 97.79,34.29 158.75,34.29 160.02,33.02 v166.37,33.02
  Bottom 0.406: D9.9 165.46,35.2 166.37,34.29 v166.37,33.02
N$43  (via drill 0.5)
  Top 0.406: H23.K 116.84,33.02 158.12,33.02 v159.38,31.75
  Bottom 0.406: D9.10 162.19,34.55 v159.38,31.75
N$44  (via drill 0.5)
  Top 0.406: H24.K 135.89,31.75 157.48,31.75 158.75,30.48 160.66,30.48 v161.93,31.75
  Bottom 0.406: D9.11 162.81,33.91 161.93,33.02 v161.93,31.75
N$45
  Bottom 0.406: D9.12 164.22,32.13 162.56,30.48 H25.K
N$46
  Bottom 0.406: H26.K 20.32,34.29 149.86,34.29 150.9,33.26 D9.13
N$47
  Bottom 0.406: H27.K 39.37,35.56 149.86,35.56 151.51,33.91 D9.14
N$48
  Bottom 0.406: H28.K 58.42,36.83 149.86,36.83 152.13,34.55 D9.15
N$49
  Bottom 0.406: H29.K 77.47,38.1 149.86,38.1 152.75,35.2 D9.16
N$50
  Bottom 0.406: H30.K 96.52,39.37 149.86,39.37 153.38,35.85 D9.17
N$51
  Bottom 0.406: H31.K 115.57,40.64 149.86,40.64 154,36.51 D9.18
N$52
  Bottom 0.406: D9.19 154.62,37.16 149.86,41.91 H32.K
N$53
  Bottom 0.406: H33.K 152.4,40.64 155.24,37.8 D9.20
N$54
  Bottom 0.406: D9.23 154.56,39.76 153.67,40.64 153.67,43.49 R32.2
N$55
  Top 0.406: V1.3 199.39,64.77 200.66,63.5 203.2,63.5 H15.CC2 H15.CC1
N$56
  Top 0.406: H16.D 195.58,58.42 203.2,58.42 H15.D
  Bottom 0.406: R25.1 181.1,63.5 183.64,60.96 185.42,60.96 186.69,59.69 186.69,58.42 | H17.D 185.42,57.15 186.69,58.42 | H16.D 193.04,58.42 186.69,58.42
N$57
  Top 0.406: H10.2 185.53,8.16 H13.4
N$58
  Top 0.406: R9.2 163.83,75.88 163.83,74.93 163.83,74.14 H1.C
N$59
  Top 0.406: H13.2 180.23,17.38 181.99,19.14 H5.4
N$62
  Top 0.406: D2.2 170.79,53.34 169.52,54.61 D1.3
N$63
  Top 0.406: H8.4 182.18,28.8 H5.2
N$64
  Top 0.406: V2.3 195.58,63.5 | 195.58,63.5 H16.CC2 | 195.58,63.5 196.85,63.5 198.12,62.23 H16.CC1
N$65
  Top 0.406: V3.3 191.77,69.85 193.04,68.58 193.04,63.5 H17.CC1 H17.CC2
N$67
  Top 0.406: H7.2 192.18,6.92 H10.4
N$68
  Top 0.406: H9.2 214.06,16.92 H12.4
N$69
  Top 0.406: H11.2 192.64,40.75 194.4,38.99 H14.4
N$70
  Top 0.406: H12.2 212.81,10.27 H4.4
N$73
  Top 0.406: H7.4 201.84,6.73 203.6,4.97 H4.2
N$78
  Bottom 0.406: R26.1 181.61,64.77 182.88,63.5 185.42,63.5 189.23,59.69 H17.C 193.04,60.96 200.66,60.96 H16.C 203.2,60.96 205.74,60.96 207.01,59.69 H15.C
N$80
  Top 0.406: H17.E 189.23,59.69 190.5,60.96 193.04,60.96 H16.E
  Bottom 0.406: H15.E 203.2,58.42 200.66,58.42 199.39,59.69 H16.E | R24.1 180.97,62.23 183.51,59.69 H17.E
PAUSE_CNT
  Top 0.406: S14.4 156.64,58.42 D1.13
PL_DIN
  Top 0.406: X1.15 215.9,71.12 D8.2
PS0
  Top 0.406: D7.3 146.05,60.96 148.59,60.96 149.86,59.69 149.86,58.42 151.13,57.15 D1.14
PS1
  Top 0.406: D7.6 140.97,58.42 148.59,58.42 151.13,55.88 D1.15
PS2
  Top 0.406: D1.16 149.86,54.61 D7.8
PS3  (via drill 0.5)
  Top 0.406: v153.67,52.07 154.94,50.8 156.21,50.8 157.44,52.03 157.44,52.56 158.22,53.34 D1.17
  Bottom 0.406: v153.67,52.07 153.67,63.5 148.59,68.58 143.51,68.58 140.97,71.12 138.43,71.12 137.16,72.39 121.92,72.39 D5.15 111.76,62.23 D6.5
PS_B0
  Top 0.406: D5.9 106.68,72.39 D7.1
PS_B1  (via drill 0.5)
  Top 0.406: D5.7 110.49,73.66 140.97,73.66 142.24,72.39 v142.24,67.31
  Bottom 0.406: D7.4 v142.24,67.31
PS_B2
  Top 0.406: D5.6 111.76,74.93 142.24,74.93 143.51,73.66 143.51,66.04 D7.10
PS_G0  (via drill 0.5)
  Top 0.406: D6.9 106.68,49.53 109.22,49.53 110.49,50.8 110.49,53.34 113.03,55.88 v133.35,55.88
  Bottom 0.406: D7.2 133.35,63.5 v133.35,55.88
PS_G1
  Top 0.406: D6.7 110.49,63.5 138.43,63.5 D7.5
PS_G2
  Top 0.406: D7.9 142.24,59.69 140.97,60.96 138.43,60.96 137.16,62.23 111.76,62.23 D6.6
PSGS  (via drill 0.5)
  Top 0.406: v144.78,72.39 144.78,67.31 D7.11
  Bottom 0.406: X1.7 189.23,77.47 176.53,77.47 172.72,73.66 146.05,73.66 v144.78,72.39
Q0_SW_BD  (via drill 0.5)
  Top 0.406: R12.1 v82.55,73.66
  Bottom 0.406: D5.3 113.03,73.66 v82.55,73.66 32.74,73.66 S2.4
Q0_SW_GD  (via drill 0.5)
  Top 0.406: R17.1 v82.55,55.88
  Bottom 0.406: D6.3 113.03,55.88 101.6,55.88 v82.55,55.88 32.74,55.88 S7.4
Q1_SW_BD  (via drill 0.5)
  Top 0.406: R13.1 v80.01,72.39
  Bottom 0.406: S3.4 51.79,72.39 v80.01,72.39 114.3,72.39 D5.2
Q1_SW_GD  (via drill 0.5)
  Top 0.406: R18.1 v85.09,54.61
  Bottom 0.406: D6.2 114.3,54.61 v85.09,54.61 51.79,54.61 S8.4
Q2_SW_BD
  Top 0.406: D5.1 119.38,80.01 82.55,80.01 77.47,74.93 | S4.3 70.41,76.91 72.39,74.93 77.47,74.93 | R14.1 77.47,74.93
Q2_SW_GD  (via drill 0.5)
  Top 0.406: v116.84,64.77 109.22,64.77 106.68,62.23 v99.06,62.23 | S9.3 71.79,57.47 74.93,57.47 R19.1
  Bottom 0.406: v116.84,64.77 D6.1 | v99.06,62.23 73.23,62.23 S9.3
Q3_SW_BD
  Top 0.406: R15.1 89.57,69.53 S5.4
  Bottom 0.406: S5.4 93.55,67.31 111.76,67.31 D5.13
Q3_SW_GD
  Top 0.406: R20.1 87.63,55.45 S10.4
  Bottom 0.406: S10.4 94.82,48.26 110.49,48.26 D6.13
RESET_CNT  (via drill 0.5)
  Top 0.406: D1.12 157.48,59.69 149.86,67.31 149.86,72.39 v147.32,74.93
  Bottom 0.406: S15.3 133.07,74.93 v147.32,74.93
RKR  (via drill 0.5)
  Top 0.406: D1.11 157.48,60.96 156.21,62.23 v156.21,63.5
  Bottom 0.406: S12.3 137.44,50.8 156.21,50.8 157.48,52.07 157.48,62.23 v156.21,63.5
SCK  (via drill 0.5)
  Top 0.406: 170.58,20.32 D4.16 | D1.1 168.91,51.66 v168.91,49.53
  Top 0.813: v181.61,41.91 170.58,30.88 170.58,20.32
  Bottom 0.406: X1.30 194.31,46.99 | D9.3 164.23,39.12 166.12,39.12 167.64,40.64
  Bottom 0.813: 194.31,46.99 189.23,41.91 v181.61,41.91 168.91,41.91 | 168.91,41.91 v168.91,49.53 167.64,50.8 160.83,50.8 159.16,52.48 D3.1 | 167.64,40.64 168.91,41.91
SRC_SW_BD  (via drill 0.5)
  Top 0.406: R11.1 v85.09,74.93
  Bottom 0.406: S1.4 13.69,74.93 v85.09,74.93 111.76,74.93 D5.4
SRC_SW_GD  (via drill 0.5)
  Top 0.406: R16.1 v80.01,57.15
  Bottom 0.406: D6.4 111.76,57.15 v80.01,57.15 13.69,57.15 S6.4
STP_CS  (via drill 0.5)
  Top 0.406: X1.33 186.69,46.99 181.61,46.99 v173.99,39.37
  Bottom 0.406: D9.4 173.07,38.45 v173.99,39.37
VREF  (via drill 0.5)
  Top 0.406: 167.64,16.51 167.64,17.12 166.62,18.14 D4.2 163.47,18.14 162.56,19.05 162.56,22.86 161.61,23.81 C5.1
  Top 0.813: 167.64,16.51 167.64,12.7 v172.72,7.62 | R8.1 158.99,23.81 C5.1
  Bottom 0.813: R8.1 155.53,27.27 153.07,27.27 152.4,27.94 138.43,27.94 | R1.1 20.24,27.94 36.83,27.94 | 138.43,27.94 118.11,27.94 | 118.11,27.94 97.79,27.94 | 97.79,27.94 77.47,27.94 | 77.47,27.94 57.15,27.94 | 57.15,27.94 36.83,27.94 | R7.1 138.43,24.21 138.43,27.94 | R6.1 118.11,24.21 118.11,27.94 | R5.1 97.79,24.21 97.79,27.94 | R4.1 77.47,24.21 77.47,27.94 | R3.1 57.15,24.21 57.15,27.94 | R2.1 36.75,27.86 36.83,27.94 | v172.72,7.62 205.74,7.62 219.71,21.59 X1.21 219.71,64.77 221.29,66.36 C7.1 221.29,69.4 X4.2

### Text on the board
Top: HWEP-Sequencer | GruS / IhnH | HTL / SBG | V2.0 / R03 | top
Bottom: bot
tValues: 3x